# EAGLE design electronics-shield (EAGLE 9.2.2)

## Sheet 1 of 8: Motor controllers
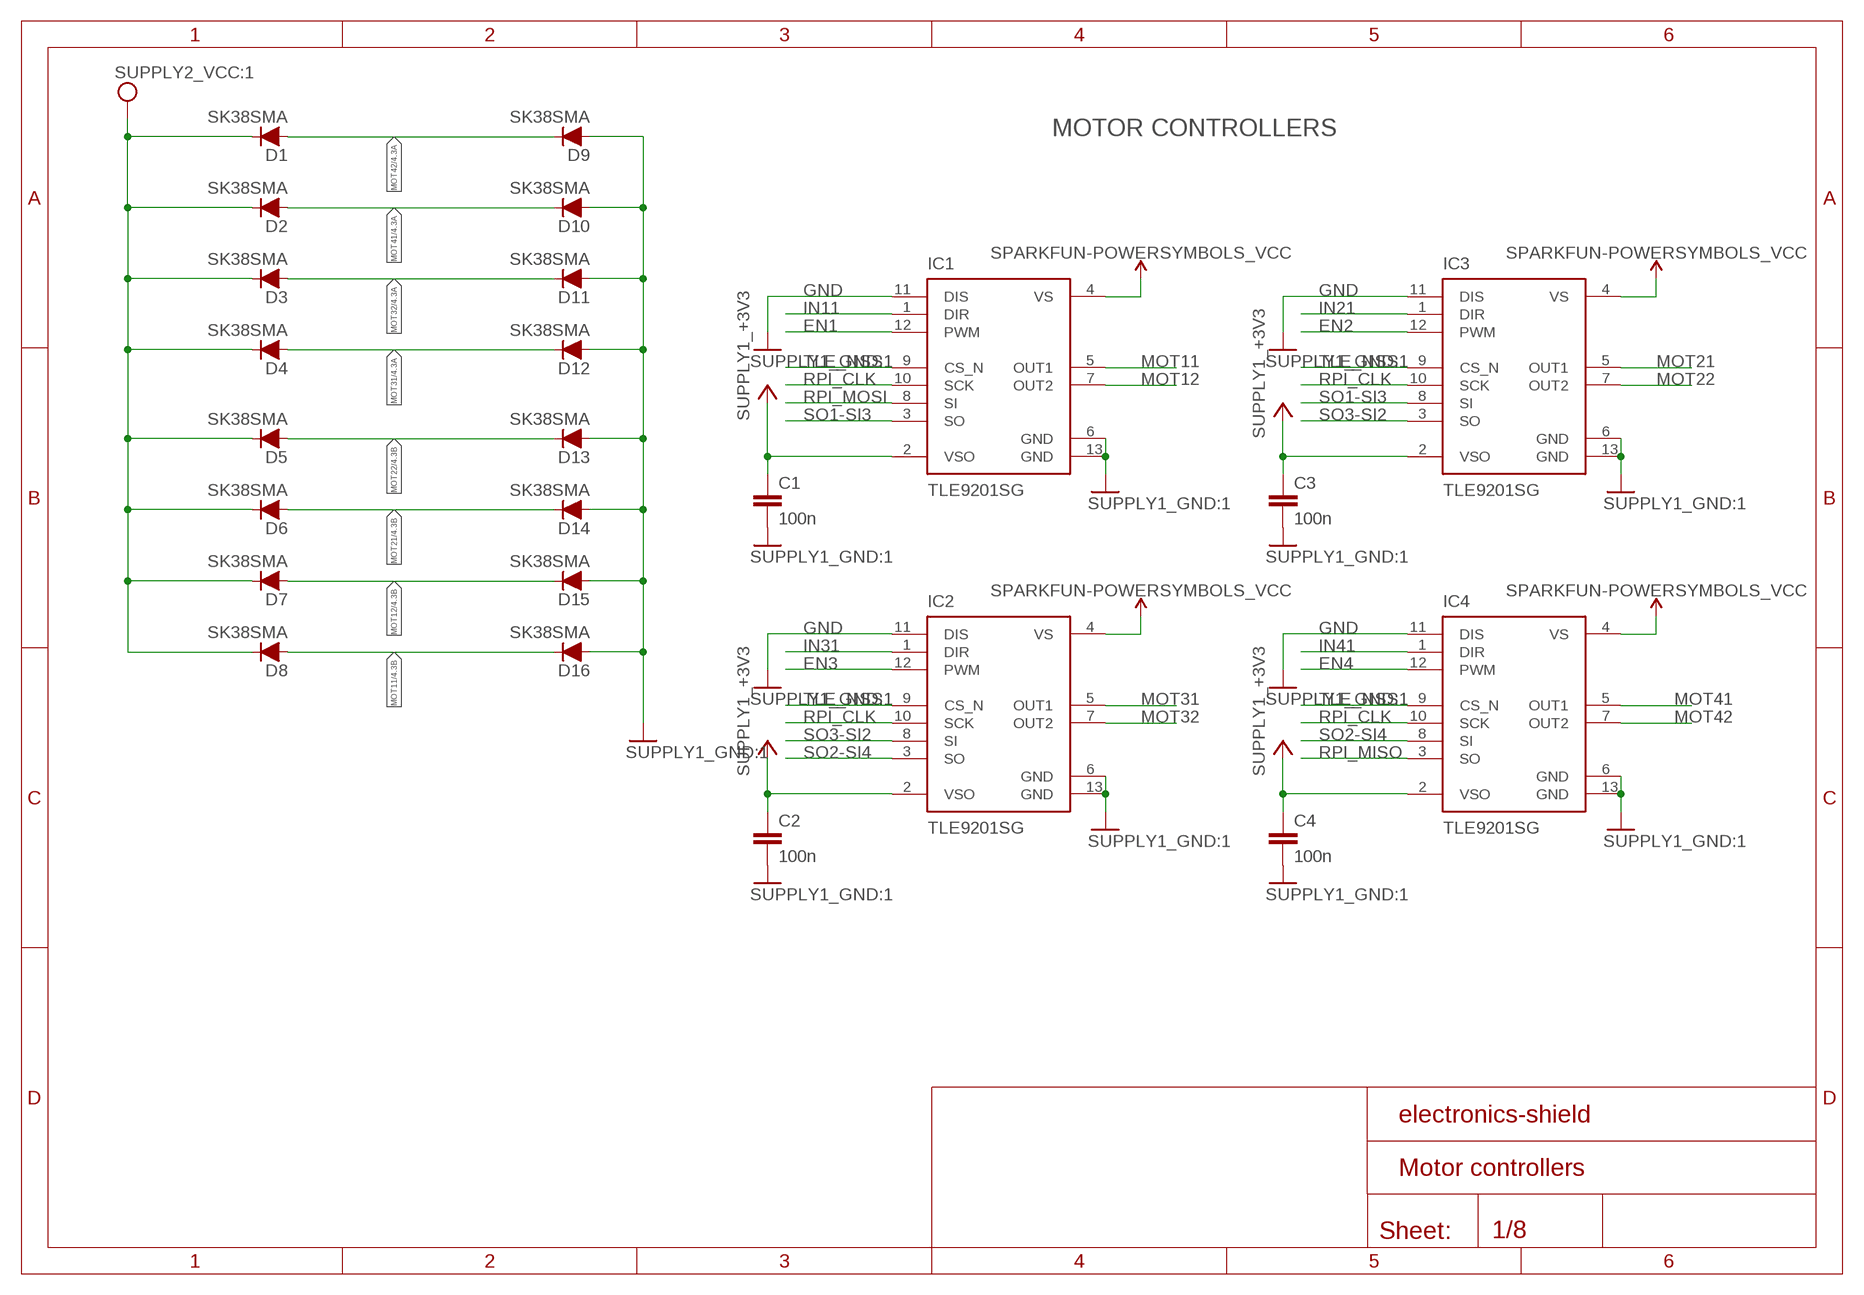
[diagram p0: schematic, sheet 1]

### Parts
C1  100n  CAPACITOR_SMD_0603  [C0603K]
C2  100n  CAPACITOR_SMD_0603  [C0603K]
C3  100n  CAPACITOR_SMD_0603  [C0603K]
C4  100n  CAPACITOR_SMD_0603  [C0603K]
D1  SK38SMA  DIODE_SMD  [SOD123]
D2  SK38SMA  DIODE_SMD  [SOD123]
D3  SK38SMA  DIODE_SMD  [SOD123]
D4  SK38SMA  DIODE_SMD  [SOD123]
D5  SK38SMA  DIODE_SMD  [SOD123]
D6  SK38SMA  DIODE_SMD  [SOD123]
D7  SK38SMA  DIODE_SMD  [SOD123]
D8  SK38SMA  DIODE_SMD  [SOD123]
D9  SK38SMA  DIODE_SMD  [SOD123]
D10  SK38SMA  DIODE_SMD  [SOD123]
D11  SK38SMA  DIODE_SMD  [SOD123]
D12  SK38SMA  DIODE_SMD  [SOD123]
D13  SK38SMA  DIODE_SMD  [SOD123]
D14  SK38SMA  DIODE_SMD  [SOD123]
D15  SK38SMA  DIODE_SMD  [SOD123]
D16  SK38SMA  DIODE_SMD  [SOD123]
IC1  TLE9201SG  [PG-DSO-12-9]
IC2  TLE9201SG  [PG-DSO-12-9]
IC3  TLE9201SG  [PG-DSO-12-9]
IC4  TLE9201SG  [PG-DSO-12-9]

### Nets
+3V3 [NET_POWER_SMALL]: C1.1 C2.1 C3.1 C4.1 IC1.2(VSO) IC2.2(VSO) IC3.2(VSO) IC4.2(VSO) ; supply symbol labelled SUPPLY1_+3V3 ; also sheet 2,3,5,7,8
EN1: IC1.12(PWM) ; also sheet 2
EN2: IC3.12(PWM) ; also sheet 2
EN3: IC2.12(PWM) ; also sheet 2
EN4: IC4.12(PWM) ; also sheet 2
GND [NET_DIFFERET]: C1.2 C2.2 C3.2 C4.2 D9.2(A) D10.2(A) D11.2(A) D12.2(A) D13.2(A) D14.2(A) D15.2(A) D16.2(A) IC1.6(GND) IC1.11(DIS) IC1.13(GND) IC2.6(GND) IC2.11(DIS) IC2.13(GND) IC3.6(GND) IC3.11(DIS) IC3.13(GND) IC4.6(GND) IC4.11(DIS) IC4.13(GND) ; supply symbol labelled SUPPLY1_GND:1 ; also sheet 2,3,4,6,7,8
IN11: IC1.1(DIR) ; also sheet 2
IN21: IC3.1(DIR) ; also sheet 2
IN31: IC2.1(DIR) ; also sheet 2
IN41: IC4.1(DIR) ; also sheet 2
MOT11 [NET_DIFFERET]: D8.2(A) D16.1(C) IC1.5(OUT1) ; also sheet 4
MOT12 [NET_DIFFERET]: D7.2(A) D15.1(C) IC1.7(OUT2) ; also sheet 4
MOT21 [NET_DIFFERET]: D6.2(A) D14.1(C) IC3.5(OUT1) ; also sheet 4
MOT22 [NET_DIFFERET]: D5.2(A) D13.1(C) IC3.7(OUT2) ; also sheet 4
MOT31 [NET_DIFFERET]: D4.2(A) D12.1(C) IC2.5(OUT1) ; also sheet 4
MOT32 [NET_DIFFERET]: D3.2(A) D11.1(C) IC2.7(OUT2) ; also sheet 4
MOT41 [NET_DIFFERET]: D2.2(A) D10.1(C) IC4.5(OUT1) ; also sheet 4
MOT42 [NET_DIFFERET]: D1.2(A) D9.1(C) IC4.7(OUT2) ; also sheet 4
RPI_CLK: IC1.10(SCK) IC2.10(SCK) IC3.10(SCK) IC4.10(SCK) ; also sheet 2,4,6
RPI_MISO: IC4.3(SO) ; also sheet 2,4,6
RPI_MOSI: IC1.8(SI) ; also sheet 2,4,6
SO1-SI3: IC1.3(SO) IC3.8(SI)
SO2-SI4: IC2.3(SO) IC4.8(SI)
SO3-SI2: IC2.8(SI) IC3.3(SO)
TLE_NSS: IC1.9(CS_N) IC2.9(CS_N) IC3.9(CS_N) IC4.9(CS_N) ; also sheet 2
VCC [NET_DIFFERET]: D1.1(C) D2.1(C) D3.1(C) D4.1(C) D5.1(C) D6.1(C) D7.1(C) D8.1(C) IC1.4(VS) IC2.4(VS) IC3.4(VS) IC4.4(VS) ; supply symbol labelled SUPPLY2_VCC:1, SPARKFUN-POWERSYMBOLS_VCC ; also sheet 3,4,8

### Notes on the sheet
- MOTOR CONTROLLERS

## Sheet 2 of 8: Microcontroller connections
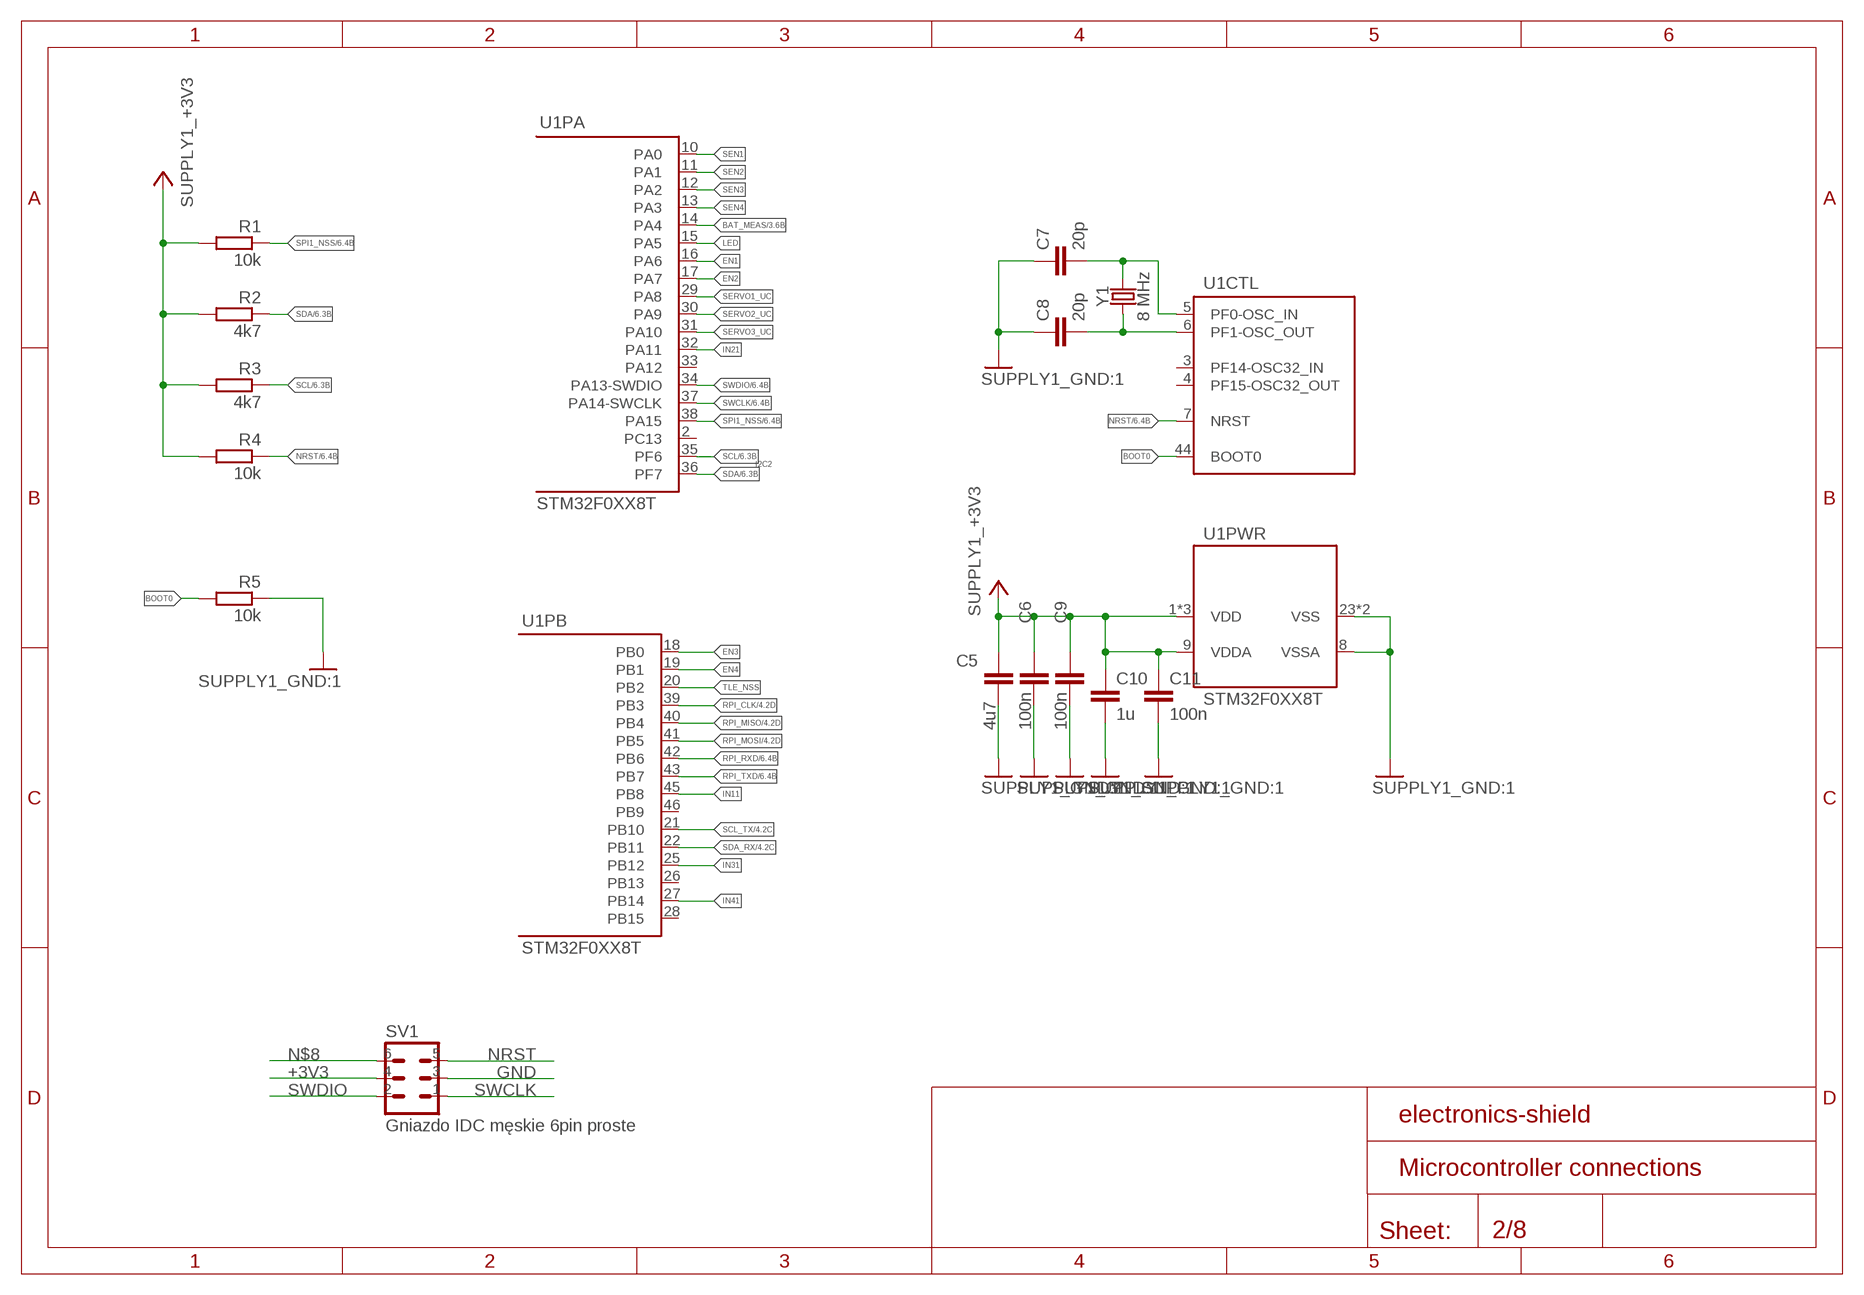
[diagram p1: schematic, sheet 2]

### Parts
C5  4u7  CAPACITOR_SMD_0603  [C0603K]
C6  100n  CAPACITOR_SMD_0603  [C0603K]
C7  20p  CAPACITOR_SMD_0603  [C0603K]
C8  20p  CAPACITOR_SMD_0603  [C0603K]
C9  100n  CAPACITOR_SMD_0603  [C0603K]
C10  1u  CAPACITOR_SMD_0603  [C0603K]
C11  100n  CAPACITOR_SMD_0603  [C0603K]
R1  10k  RESISTOR_SMD_0603  [R0603]
R2  4k7  RESISTOR_SMD_0603  [R0603]
R3  4k7  RESISTOR_SMD_0603  [R0603]
R4  10k  RESISTOR_SMD_0603  [R0603]
R5  10k  RESISTOR_SMD_0603  [R0603]
SV1  Gniazdo IDC męskie 6pin proste  ML6  [ML6]
U1  STM32F0XX8T  [LQFP48]
Y1  8 MHz  CRYSTAL  [HC49UP]

### Nets
+3V3 [NET_POWER_SMALL]: C5.1 C6.1 C9.1 C10.1 C11.1 R1.2 R2.2 R3.2 R4.2 SV1.4 U1.1(PWR:VDD) U1.9(PWR:VDDA) U1.24(PWR:VDD) U1.48(PWR:VDD) ; supply symbol labelled SUPPLY1_+3V3 ; also sheet 1,3,5,7,8
BAT_MEAS: U1.14(PA:PA4) ; also sheet 3
BOOT0: R5.2 U1.44(CTL:BOOT0)
EN1: U1.16(PA:PA6) ; also sheet 1
EN2: U1.17(PA:PA7) ; also sheet 1
EN3: U1.18(PB:PB0) ; also sheet 1
EN4: U1.19(PB:PB1) ; also sheet 1
GND [NET_DIFFERET]: C5.2 C6.2 C7.1 C8.1 C9.2 C10.2 C11.2 R5.1 SV1.3 U1.8(PWR:VSSA) U1.23(PWR:VSS) U1.47(PWR:VSS) ; supply symbol labelled SUPPLY1_GND:1 ; also sheet 1,3,4,6,7,8
IN11: U1.45(PB:PB8) ; also sheet 1
IN21: U1.32(PA:PA11) ; also sheet 1
IN31: U1.25(PB:PB12) ; also sheet 1
IN41: U1.27(PB:PB14) ; also sheet 1
LED: U1.15(PA:PA5)
N$8: SV1.6
NRST: R4.1 SV1.5 U1.7(CTL:NRST) ; also sheet 6
OSCILATOR_N [DIFF_PAIR]: C7.2 U1.5(CTL:PF0-OSC_IN) Y1.2
OSCILATOR_P [DIFF_PAIR]: C8.2 U1.6(CTL:PF1-OSC_OUT) Y1.1
RPI_CLK: U1.39(PB:PB3) ; also sheet 1,4,6
RPI_MISO: U1.40(PB:PB4) ; also sheet 1,4,6
RPI_MOSI: U1.41(PB:PB5) ; also sheet 1,4,6
RPI_RXD: U1.42(PB:PB6) ; also sheet 6
RPI_TXD: U1.43(PB:PB7) ; also sheet 6
SCL: R3.1 U1.35(PA:PF6) ; also sheet 6,7
SCL_TX: U1.21(PB:PB10) ; also sheet 4
SDA: R2.1 U1.36(PA:PF7) ; also sheet 6,7
SDA_RX: U1.22(PB:PB11) ; also sheet 4
SEN1: U1.10(PA:PA0)
SEN2: U1.11(PA:PA1)
SEN3: U1.12(PA:PA2)
SEN4: U1.13(PA:PA3)
SERVO1_UC: U1.29(PA:PA8) ; also sheet 5
SERVO2_UC: U1.30(PA:PA9) ; also sheet 5
SERVO3_UC: U1.31(PA:PA10) ; also sheet 5
SPI1_NSS: R1.1 U1.38(PA:PA15) ; also sheet 6
SWCLK: SV1.1 U1.37(PA:PA14-SWCLK) ; also sheet 6
SWDIO: SV1.2 U1.34(PA:PA13-SWDIO) ; also sheet 6
TLE_NSS: U1.20(PB:PB2) ; also sheet 1
Unconnected: U1.2(PA:PC13) U1.3(CTL:PF14-OSC32_IN) U1.4(CTL:PF15-OSC32_OUT) U1.26(PB:PB13) U1.28(PB:PB15) U1.33(PA:PA12) U1.46(PB:PB9)

### Notes on the sheet
- I2C2

## Sheet 3 of 8: Power supply
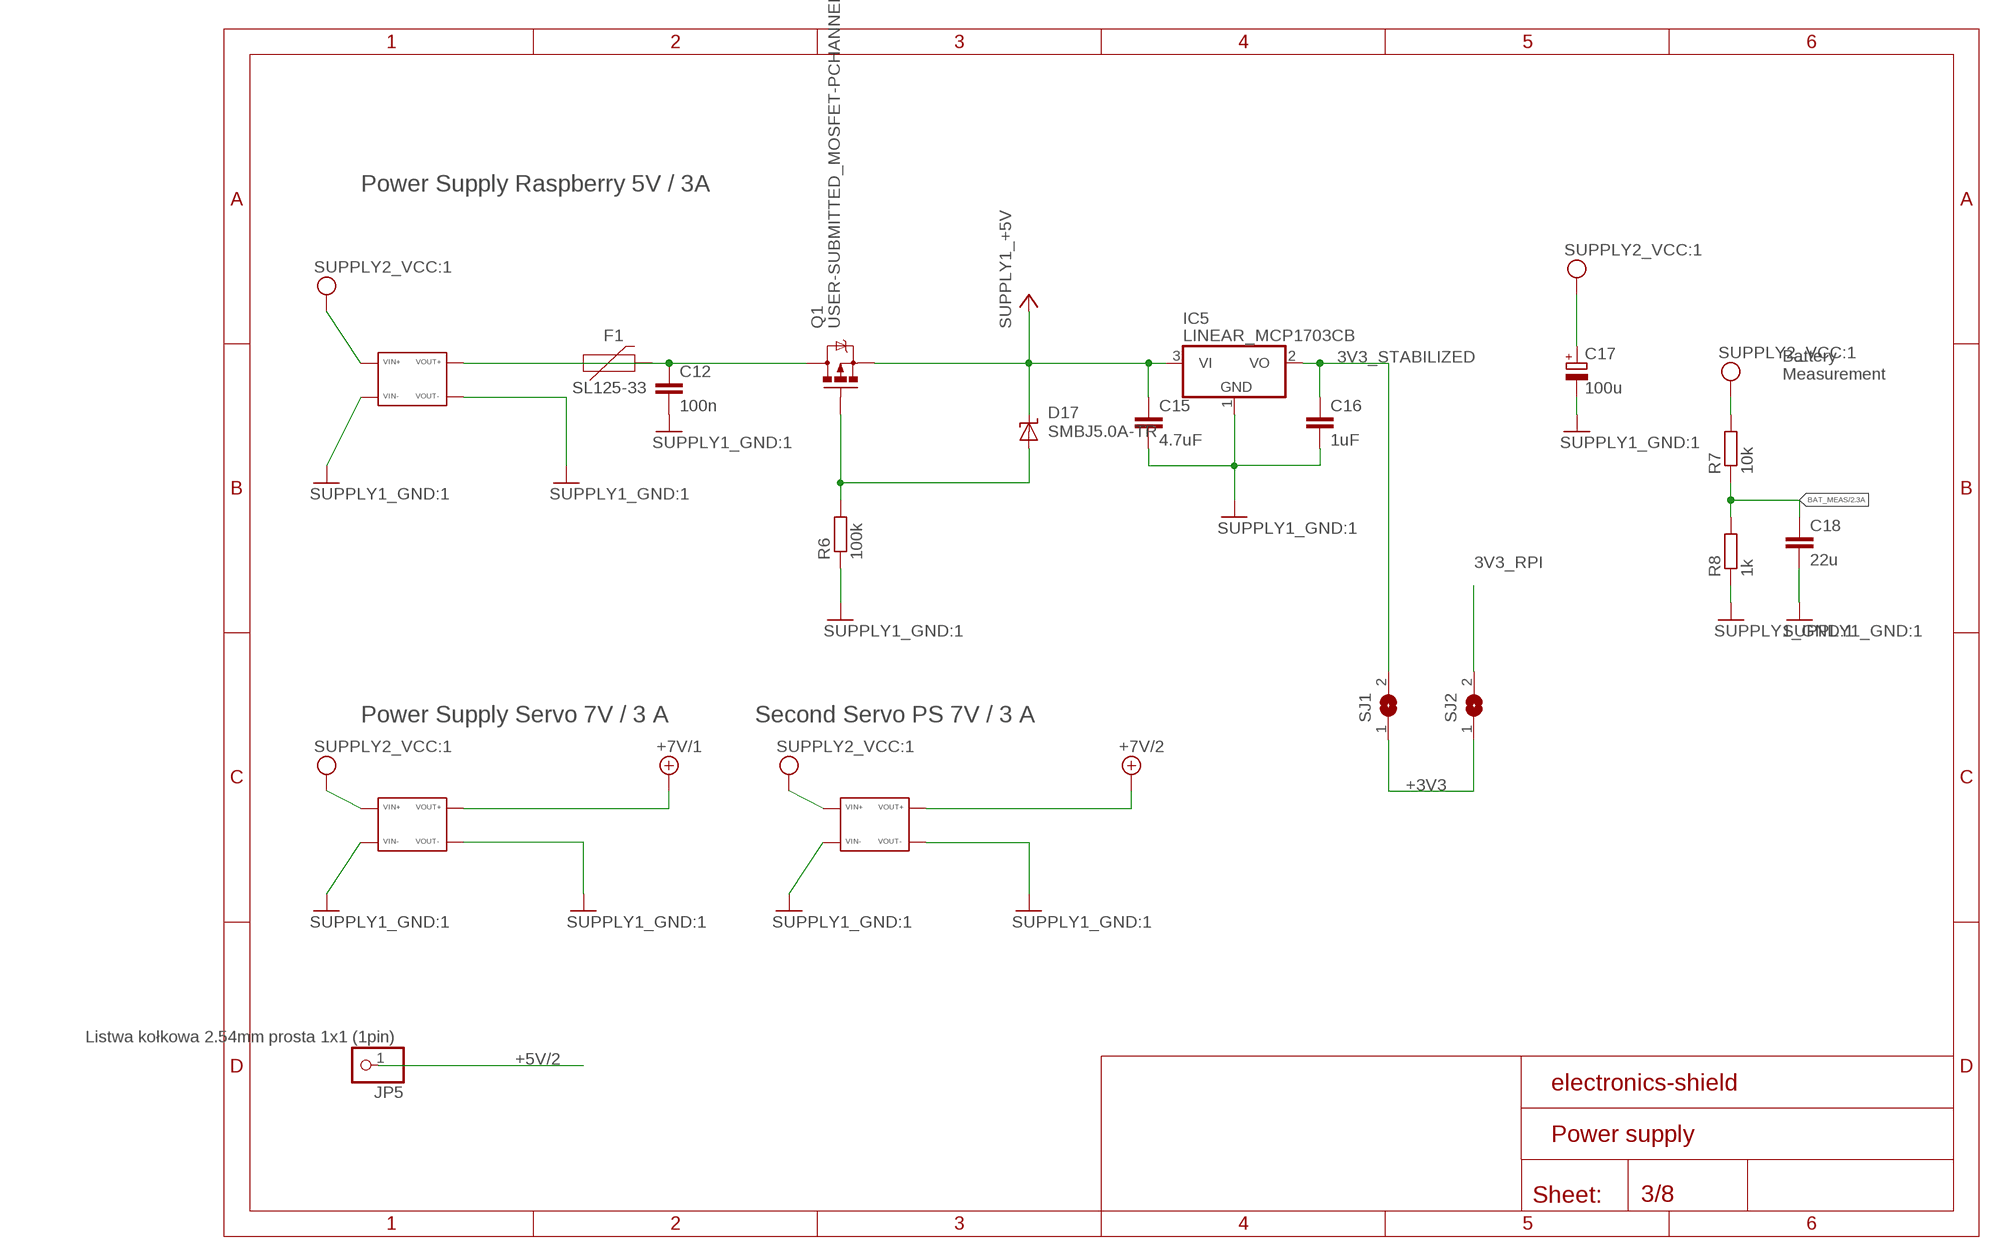
[diagram p2: schematic, sheet 3]

### Parts
C12  100n  CAPACITOR_SMD_0603  [C0603K]
C15  4.7uF  CAPACITOR_SMD_0603  [C0603K]
C16  1uF  CAPACITOR_SMD_0603  [C0603K]
C17  100u  CAPACITOR_POL_SMD  [FI8_6.2]
C18  22u  CAPACITOR_SMD_0603  [C0603K]
D17  SMBJ5.0A-TR  SUPPRESSOR-SMBJ  [SMBJ]
F1  SL125-33  PPTCD  [FUSC7351X125]
IC5  LINEAR_MCP1703CB  [LINEAR_SOT23]
IC6  Moduł przetwornicy DC-DC Step-down 4.5..28V --- regulowane 0.8..20V MP1584  MP1584_MODULE  [DC-BRICK]
IC7  Moduł przetwornicy DC-DC Step-down 4.5..28V --- regulowane 0.8..20V MP1584  MP1584_MODULE  [DC-BRICK]
IC8  Moduł przetwornicy DC-DC Step-down 4.5..28V --- regulowane 0.8..20V MP1584  MP1584_MODULE  [DC-BRICK]
JP5  Listwa kołkowa 2.54mm prosta 1x1 (1pin)  PINHD-1X1  [1X01]
Q1  USER-SUBMITTED_MOSFET-PCHANNELSMD  [USER-SUBMITTED_SOT23-3]
R6  100k  RESISTOR_SMD_0603  [R0603]
R7  10k  RESISTOR_SMD_0603  [R0603]
R8  1k  RESISTOR_SMD_0603  [R0603]
SJ1  SOLDER_JUMPER  [SJ]
SJ2  SOLDER_JUMPER  [SJ]

### Nets
3V3_RPI: SJ2.2 ; also sheet 6
3V3_STABILIZED: C16.1 IC5.2(VO) SJ1.2
5V_NOT_TRIMMED [NET_DIFFERET]: C12.1 F1.1 Q1.3(D)
+3V3 [NET_POWER_SMALL]: SJ1.1 SJ2.1 ; also sheet 1,2,5,7,8
+5V [NET_POWER_SMALL]: C15.1 D17.C IC5.3(VI) Q1.2(S) ; supply symbol labelled SUPPLY1_+5V ; also sheet 4,5,6,8
+5V/2 [NET_POWER_SMALL]: JP5.1 ; also sheet 4
+5V_RAW [NET_DIFFERET]: F1.2 IC6.OUT1+1(VOUT+)
+7V/1 [NET_DIFFERET]: IC7.OUT1+1(VOUT+) ; also sheet 4
+7V/2 [NET_DIFFERET]: IC8.OUT1+1(VOUT+) ; also sheet 4
BAT_MEAS: C18.1 R7.1 R8.2 ; also sheet 2
D1-R3 [NET_DIFFERET]: D17.A Q1.1(G) R6.2
GND [NET_DIFFERET]: C12.2 C15.2 C16.2 C17.- C18.2 IC5.1(GND) IC6.IN1-1(VIN-) IC6.OUT1-1(VOUT-) IC7.IN1-1(VIN-) IC7.OUT1-1(VOUT-) IC8.IN1-1(VIN-) IC8.OUT1-1(VOUT-) R6.1 R8.1 ; supply symbol labelled SUPPLY1_GND:1 ; also sheet 1,2,4,6,7,8
VCC [NET_DIFFERET]: C17.+ IC6.IN1+1(VIN+) IC7.IN1+1(VIN+) IC8.IN1+1(VIN+) R7.2 ; supply symbol labelled SUPPLY2_VCC:1 ; also sheet 1,4,8

### Notes on the sheet
- Power Supply Raspberry 5V / 3A
- Battery
  Measurement
- Power Supply Servo 7V / 3 A | Second Servo PS 7V / 3 A

## Sheet 4 of 8: Connectors
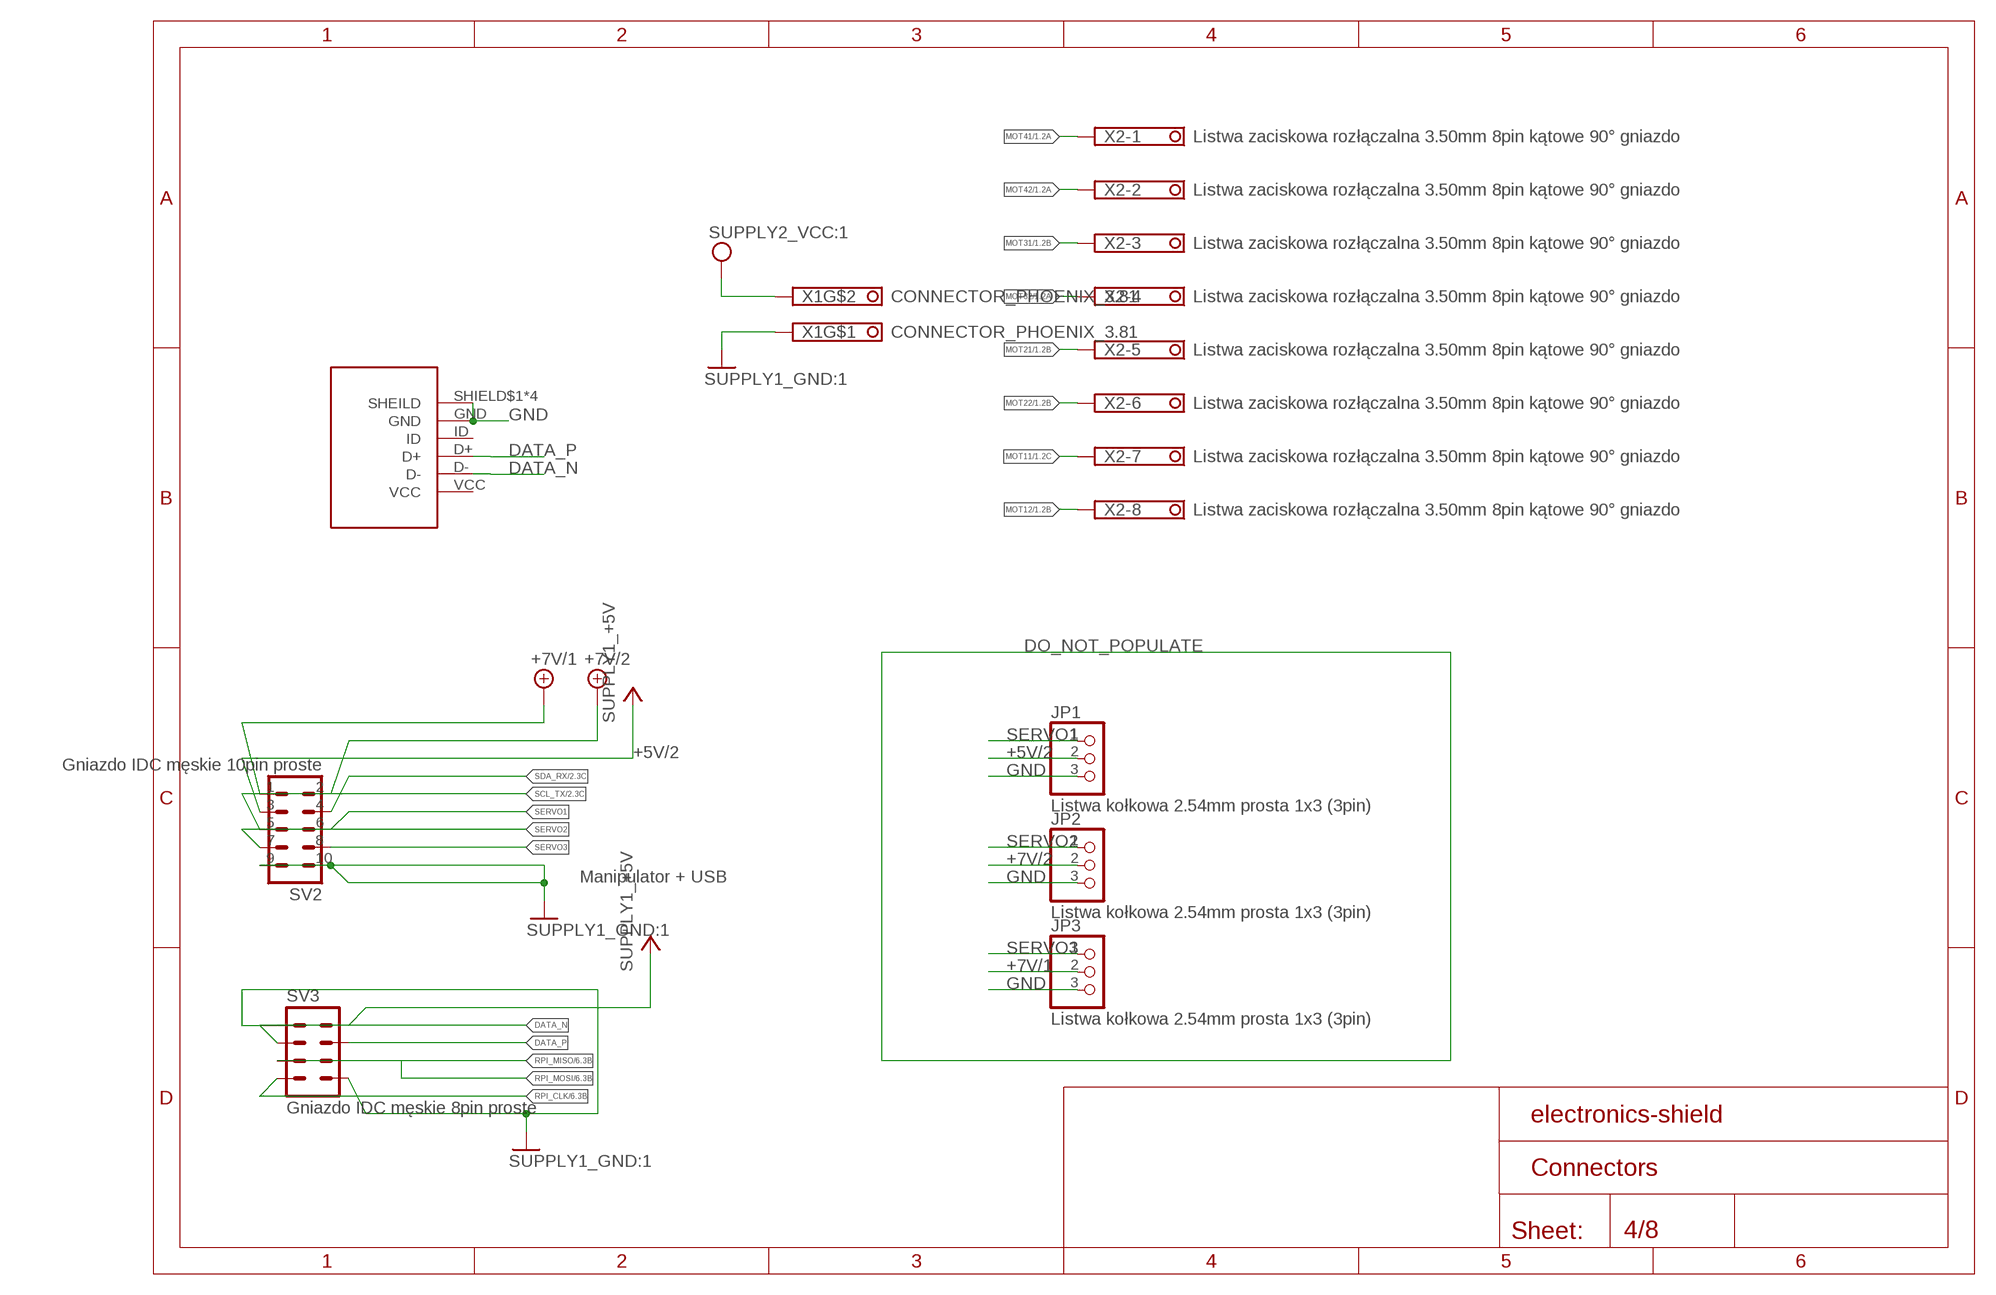
[diagram p3: schematic, sheet 4]

### Parts
J1  USB-MICRO-B  [USB-MICRO-B]
JP1  Listwa kołkowa 2.54mm prosta 1x3 (3pin)  PINHD-1X3_DNP  [1X03_ROUND_DNP]
JP2  Listwa kołkowa 2.54mm prosta 1x3 (3pin)  PINHD-1X3_DNP  [1X03_ROUND_DNP]
JP3  Listwa kołkowa 2.54mm prosta 1x3 (3pin)  PINHD-1X3_DNP  [1X03_ROUND_DNP]
SV2  Gniazdo IDC męskie 10pin proste  ML10  [ML10]
SV3  Gniazdo IDC męskie 8pin proste  ML8  [ML8]
X1  CONNECTOR_PHOENIX_3.81  [3.81MM_2PIN]
X2  Listwa zaciskowa rozłączalna 3.50mm 8pin kątowe 90° gniazdo  CONNECTOR_PHOENIX  [3.5MM_8PIN]

### Nets
+5V [NET_POWER_SMALL]: SV3.2 ; supply symbol labelled SUPPLY1_+5V ; also sheet 3,5,6,8
+5V/2 [NET_POWER_SMALL]: JP1.2 SV2.3 ; supply symbol labelled SUPPLY1_+5V ; also sheet 3
+7V/1 [NET_DIFFERET]: JP3.2 SV2.1 ; also sheet 3
+7V/2 [NET_DIFFERET]: JP2.2 SV2.2 ; also sheet 3
DATA_N [DIFF_PAIR2]: J1.D- SV3.3
DATA_P [DIFF_PAIR2]: J1.D+ SV3.4
GND [NET_DIFFERET]: J1.GND J1.SHIELD$1(SHEILD) J1.SHIELD$2(SHEILD) J1.SHIELD$3(SHEILD) J1.SHIELD$4(SHEILD) JP1.3 JP2.3 JP3.3 SV2.9 SV2.10 SV3.1 SV3.8 X1.1 ; supply symbol labelled SUPPLY1_GND:1 ; also sheet 1,2,3,6,7,8
MOT11 [NET_DIFFERET]: X2.7 ; also sheet 1
MOT12 [NET_DIFFERET]: X2.8 ; also sheet 1
MOT21 [NET_DIFFERET]: X2.5 ; also sheet 1
MOT22 [NET_DIFFERET]: X2.6 ; also sheet 1
MOT31 [NET_DIFFERET]: X2.3 ; also sheet 1
MOT32 [NET_DIFFERET]: X2.4 ; also sheet 1
MOT41 [NET_DIFFERET]: X2.1 ; also sheet 1
MOT42 [NET_DIFFERET]: X2.2 ; also sheet 1
RPI_CLK: SV3.7 ; also sheet 1,2,6
RPI_MISO: SV3.5 ; also sheet 1,2,6
RPI_MOSI: SV3.6 ; also sheet 1,2,6
SCL_TX: SV2.5 ; also sheet 2
SDA_RX: SV2.4 ; also sheet 2
SERVO1: JP1.1 SV2.6 ; also sheet 5
SERVO2: JP2.1 SV2.7 ; also sheet 5
SERVO3: JP3.1 SV2.8 ; also sheet 5
VCC [NET_DIFFERET]: X1.2 ; supply symbol labelled SUPPLY2_VCC:1 ; also sheet 1,3,8
Unconnected: J1.ID J1.VCC

### Notes on the sheet
- Manipulator + USB

## Sheet 5 of 8: Voltage level translators
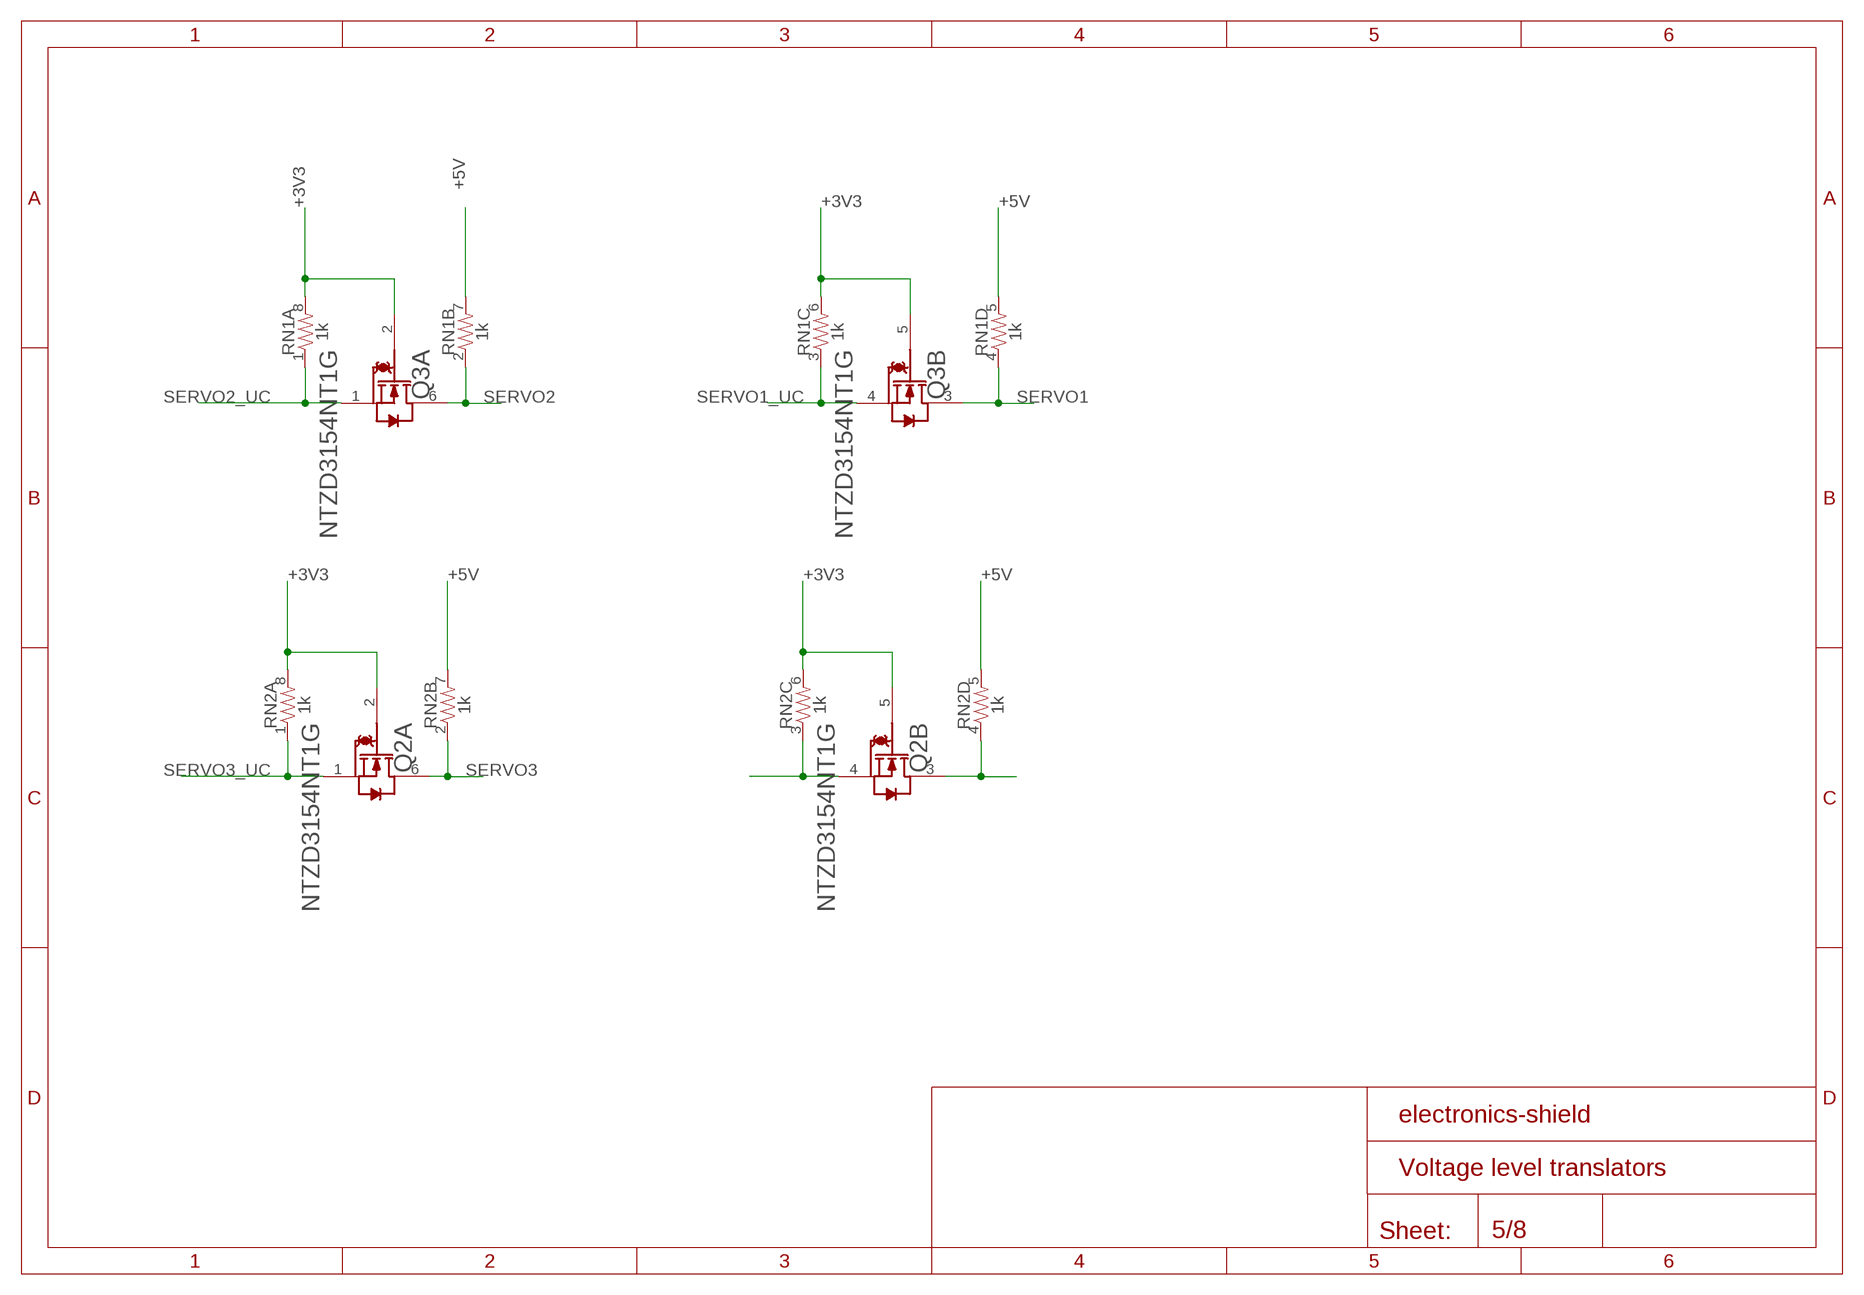
[diagram p4: schematic, sheet 5]

### Parts
Q2  NTZD3154NT1G  ON-SEMICONDUCTOR---NTZD3154NT1G_ON_SEMICONDUCTOR_NTZD3154NT1GON_SEMICONDUCTOR_NTZD3154NT1G_0_0  [ON-SEMICONDUCTOR---NTZD3154NT1G_ON_SEMICONDUCTOR_NTZD3154NT1G_0]
Q3  NTZD3154NT1G  ON-SEMICONDUCTOR---NTZD3154NT1G_ON_SEMICONDUCTOR_NTZD3154NT1GON_SEMICONDUCTOR_NTZD3154NT1G_0_0  [ON-SEMICONDUCTOR---NTZD3154NT1G_ON_SEMICONDUCTOR_NTZD3154NT1G_0]
RN1  1k  1KOHM-ARRAY(4)-0805_ARV-1/10W-5%  [0805-ARV]
RN2  1k  1KOHM-ARRAY(4)-0805_ARV-1/10W-5%  [0805-ARV]

### Nets
+3V3 [NET_POWER_SMALL]: Q2.2(A:G1) Q2.5(B:G2) Q3.2(A:G1) Q3.5(B:G2) RN1.6 RN1.8 RN2.6 RN2.8 ; also sheet 1,2,3,7,8
+5V [NET_POWER_SMALL]: RN1.5 RN1.7 RN2.5 RN2.7 ; also sheet 3,4,6,8
N$14: Q2.4(B:S2) RN2.3
N$16: Q2.3(B:D2) RN2.4
SERVO1: Q3.3(B:D2) RN1.4 ; also sheet 4
SERVO1_UC: Q3.4(B:S2) RN1.3 ; also sheet 2
SERVO2: Q3.6(A:D1) RN1.2 ; also sheet 4
SERVO2_UC: Q3.1(A:S1) RN1.1 ; also sheet 2
SERVO3: Q2.6(A:D1) RN2.2 ; also sheet 4
SERVO3_UC: Q2.1(A:S1) RN2.1 ; also sheet 2

## Sheet 6 of 8: RPi connections
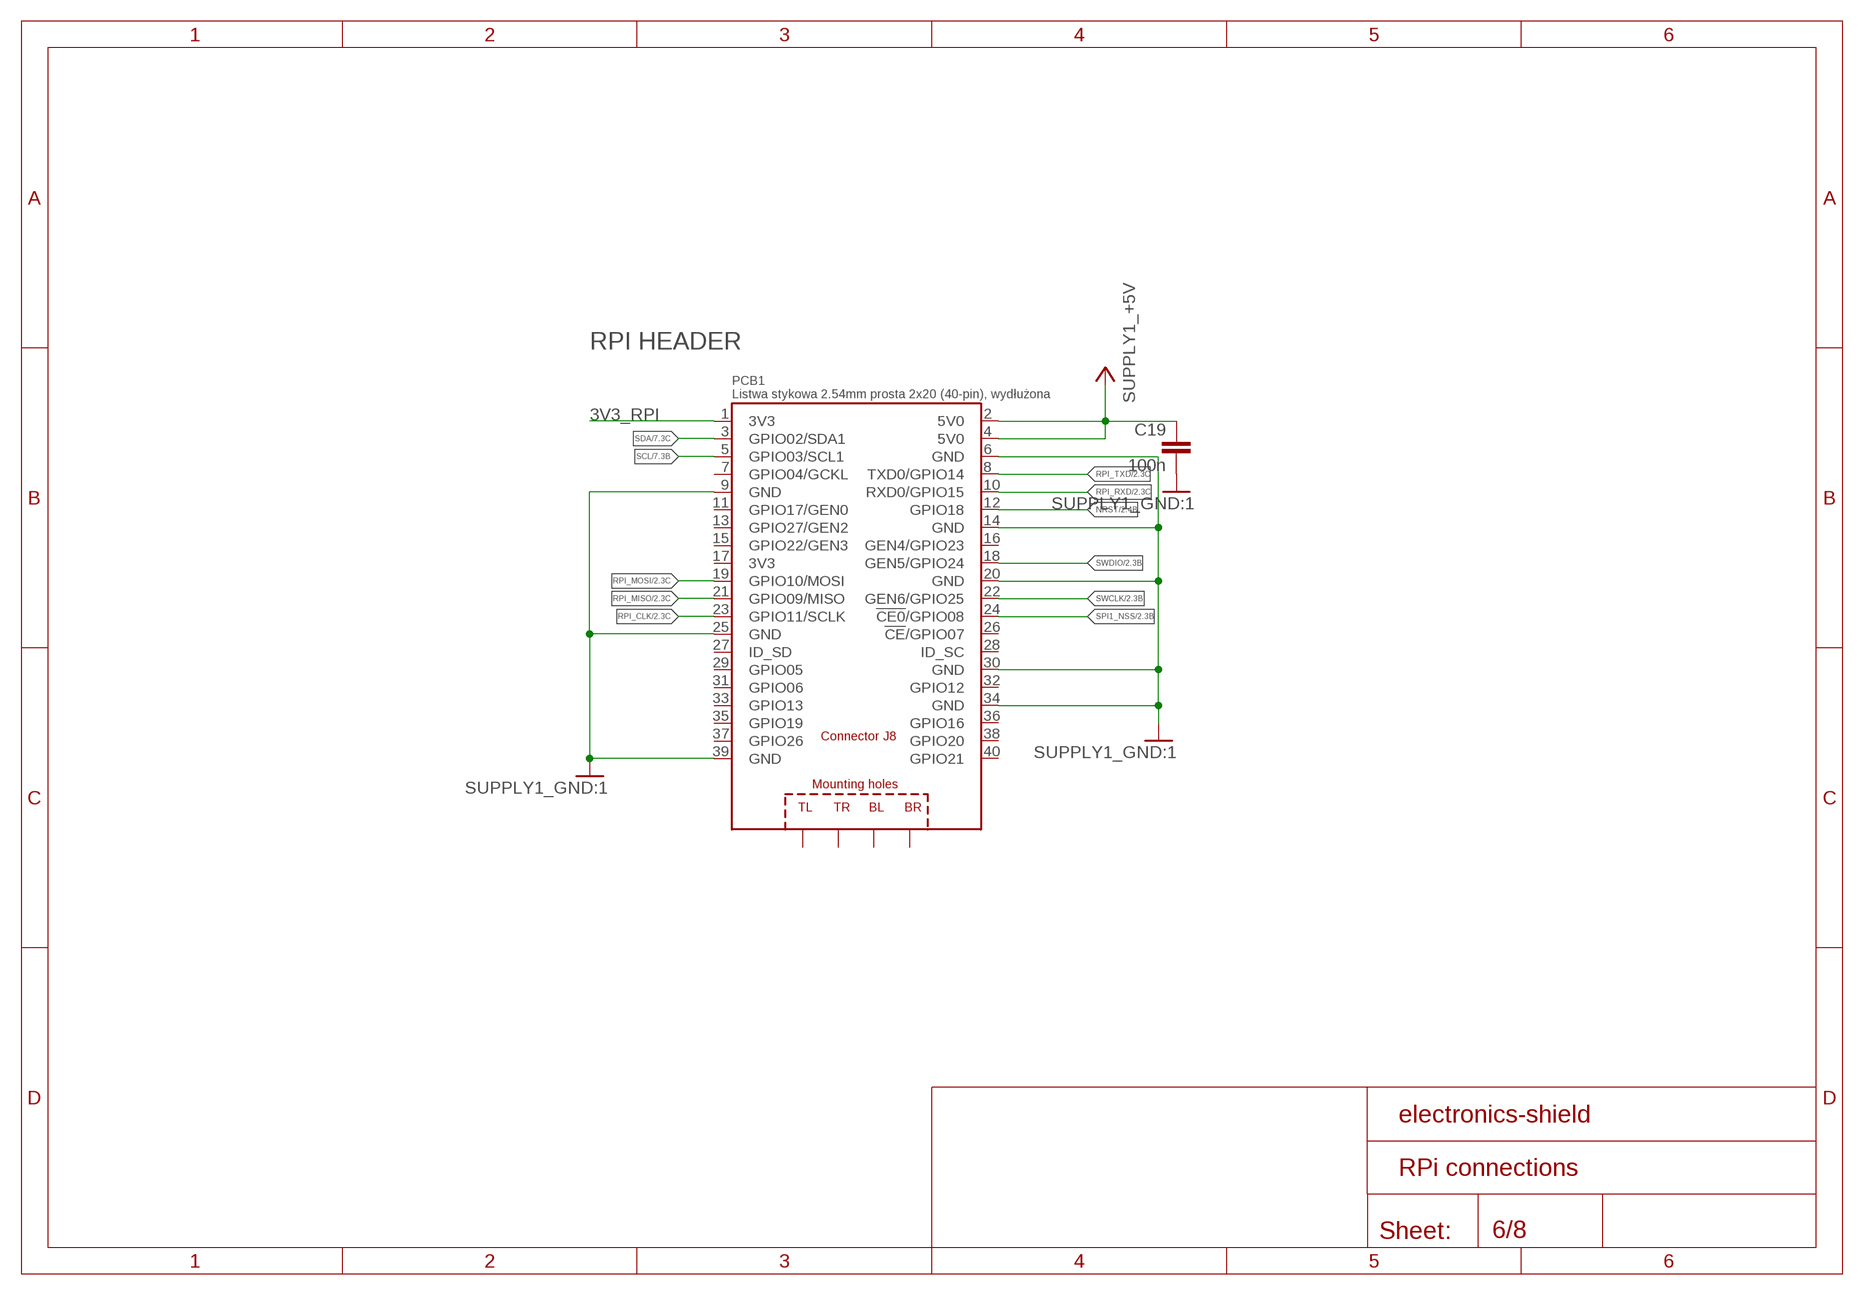
[diagram p5: schematic, sheet 6]

### Parts
C19  100n  CAPACITOR_SMD_0603  [C0603K]
PCB1  Listwa stykowa 2.54mm prosta 2x20 (40-pin), wydłużona  RASPBERRY_PI_B+_TPLACE  [RASPBERRY_PI_B+_CONNECTOR]

### Nets
3V3_RPI: PCB1.1(3V3) ; also sheet 3
+5V [NET_POWER_SMALL]: C19.1 PCB1.2(5V0) PCB1.4(5V0) ; supply symbol labelled SUPPLY1_+5V ; also sheet 3,4,5,8
GND [NET_DIFFERET]: C19.2 PCB1.6(GND) PCB1.9(GND) PCB1.14(GND) PCB1.20(GND) PCB1.25(GND) PCB1.30(GND) PCB1.34(GND) PCB1.39(GND) ; supply symbol labelled SUPPLY1_GND:1 ; also sheet 1,2,3,4,7,8
NRST: PCB1.12(GPIO18) ; also sheet 2
RPI_CLK: PCB1.23(GPIO11/SCLK) ; also sheet 1,2,4
RPI_MISO: PCB1.21(GPIO09/MISO) ; also sheet 1,2,4
RPI_MOSI: PCB1.19(GPIO10/MOSI) ; also sheet 1,2,4
RPI_RXD: PCB1.10(RXD0/GPIO15) ; also sheet 2
RPI_TXD: PCB1.8(TXD0/GPIO14) ; also sheet 2
SCL: PCB1.5(GPIO03/SCL1) ; also sheet 2,7
SDA: PCB1.3(GPIO02/SDA1) ; also sheet 2,7
SPI1_NSS: PCB1.24(!CE0!/GPIO08) ; also sheet 2
SWCLK: PCB1.22(GEN6/GPIO25) ; also sheet 2
SWDIO: PCB1.18(GEN5/GPIO24) ; also sheet 2
Unconnected: PCB1.7(GPIO04/GCKL) PCB1.11(GPIO17/GEN0) PCB1.13(GPIO27/GEN2) PCB1.15(GPIO22/GEN3) PCB1.16(GEN4/GPIO23) PCB1.26(!CE!/GPIO07) PCB1.27(ID_SD) PCB1.28(ID_SC) PCB1.29(GPIO05) PCB1.31(GPIO06) PCB1.32(GPIO12) PCB1.33(GPIO13) PCB1.35(GPIO19) PCB1.36(GPIO16) PCB1.37(GPIO26) PCB1.38(GPIO20) PCB1.40(GPIO21) PCB1.PE_BL(BL) PCB1.PE_BR(BR) PCB1.PE_TL(TL) PCB1.PE_TR(TR)

### Notes on the sheet
- RPI HEADER

## Sheet 7 of 8: EEPROM
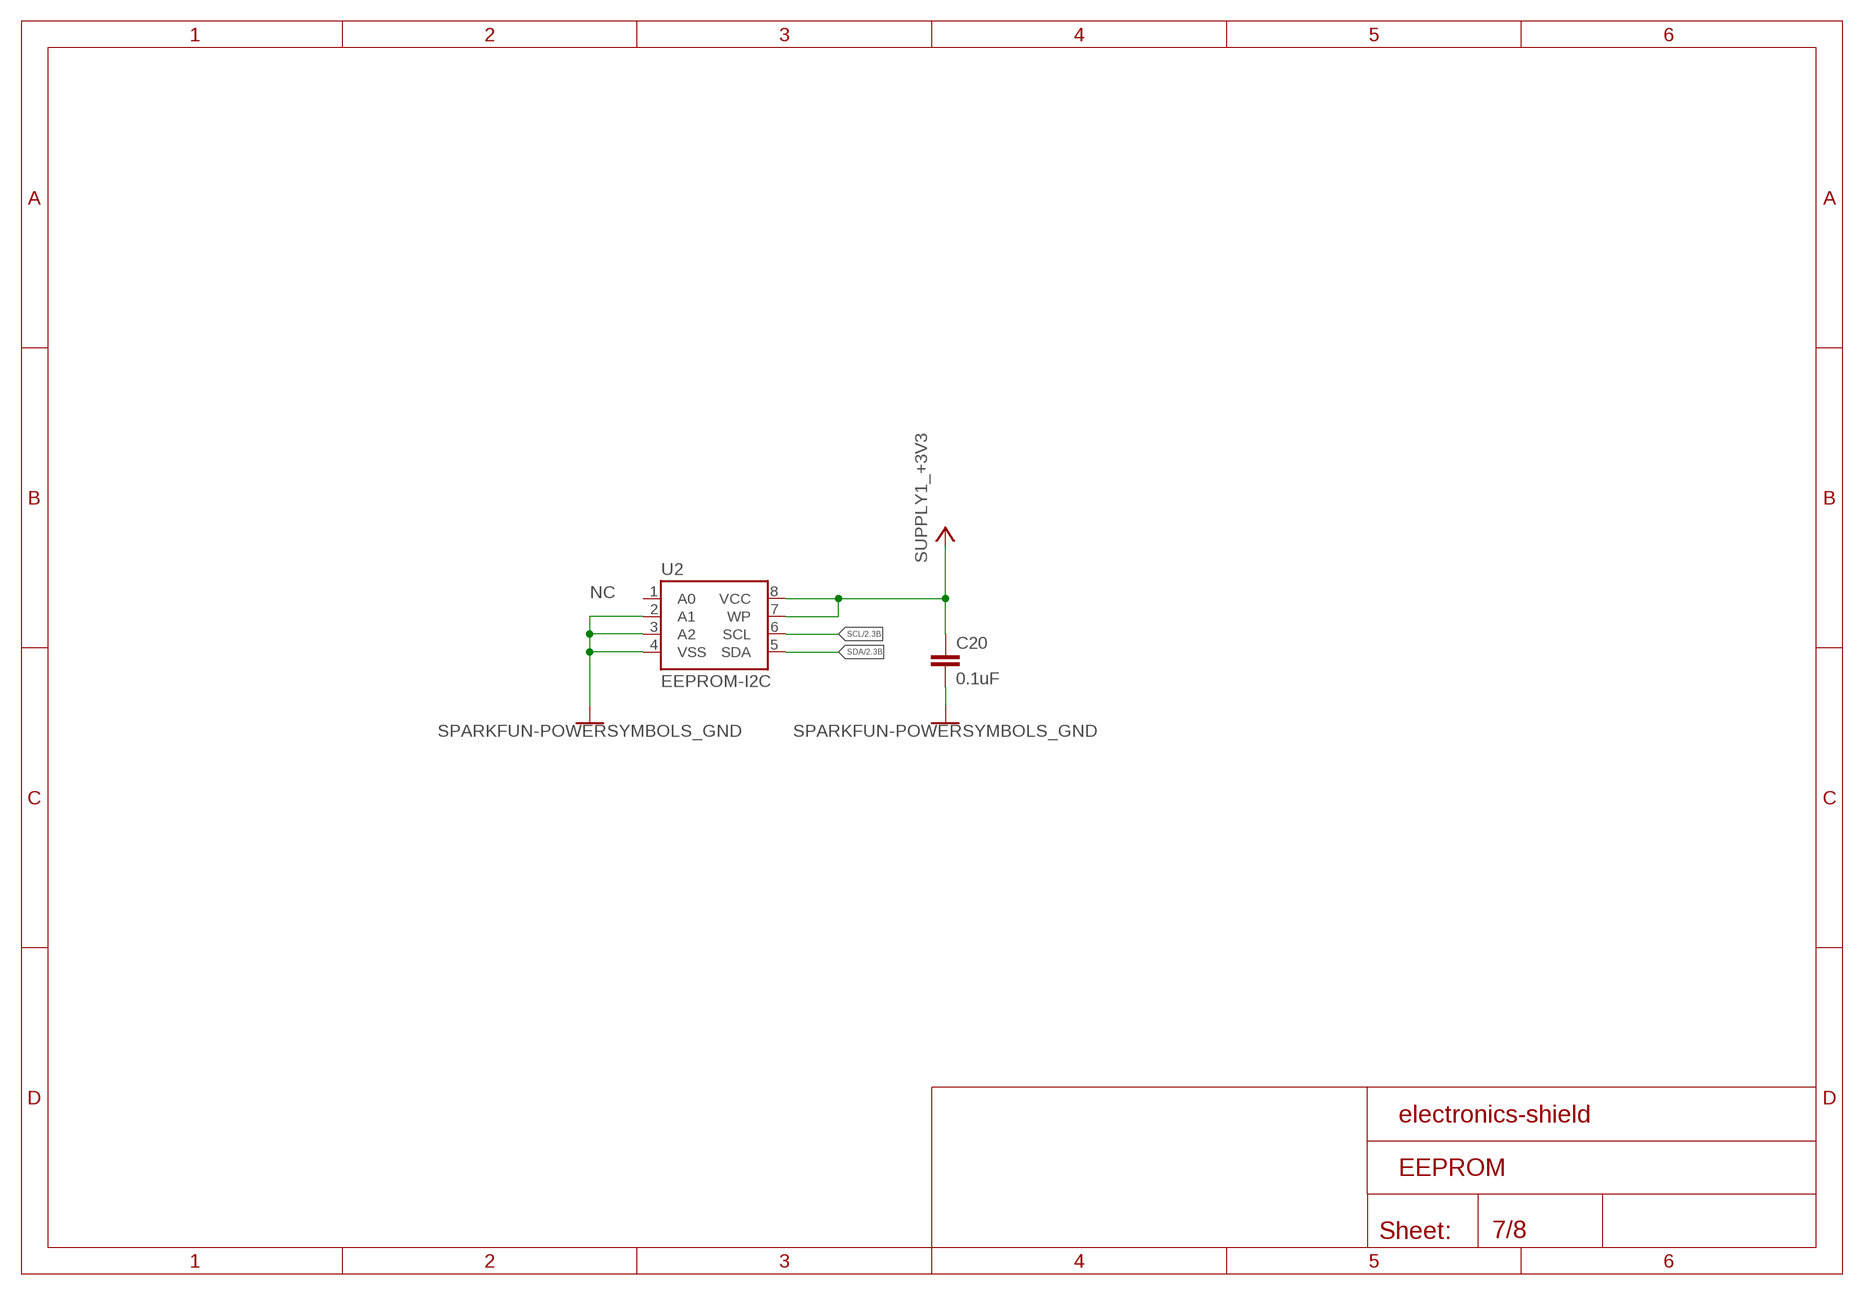
[diagram p6: schematic, sheet 7]

### Parts
C20  0.1uF  CAPACITOR_SMD_0603  [C0603K]
U2  EEPROM-I2C  [SO-08]

### Nets
+3V3 [NET_POWER_SMALL]: C20.1 U2.7(WP) U2.8(VCC) ; supply symbol labelled SUPPLY1_+3V3 ; also sheet 1,2,3,5,8
GND [NET_DIFFERET]: C20.2 U2.2(A1) U2.3(A2) U2.4(VSS) ; supply symbol labelled SPARKFUN-POWERSYMBOLS_GND ; also sheet 1,2,3,4,6,8
SCL: U2.6(SCL) ; also sheet 2,6
SDA: U2.5(SDA) ; also sheet 2,6
Unconnected: U2.1(A0)

### Notes on the sheet
- NC

## Sheet 8 of 8: TEST POINTS
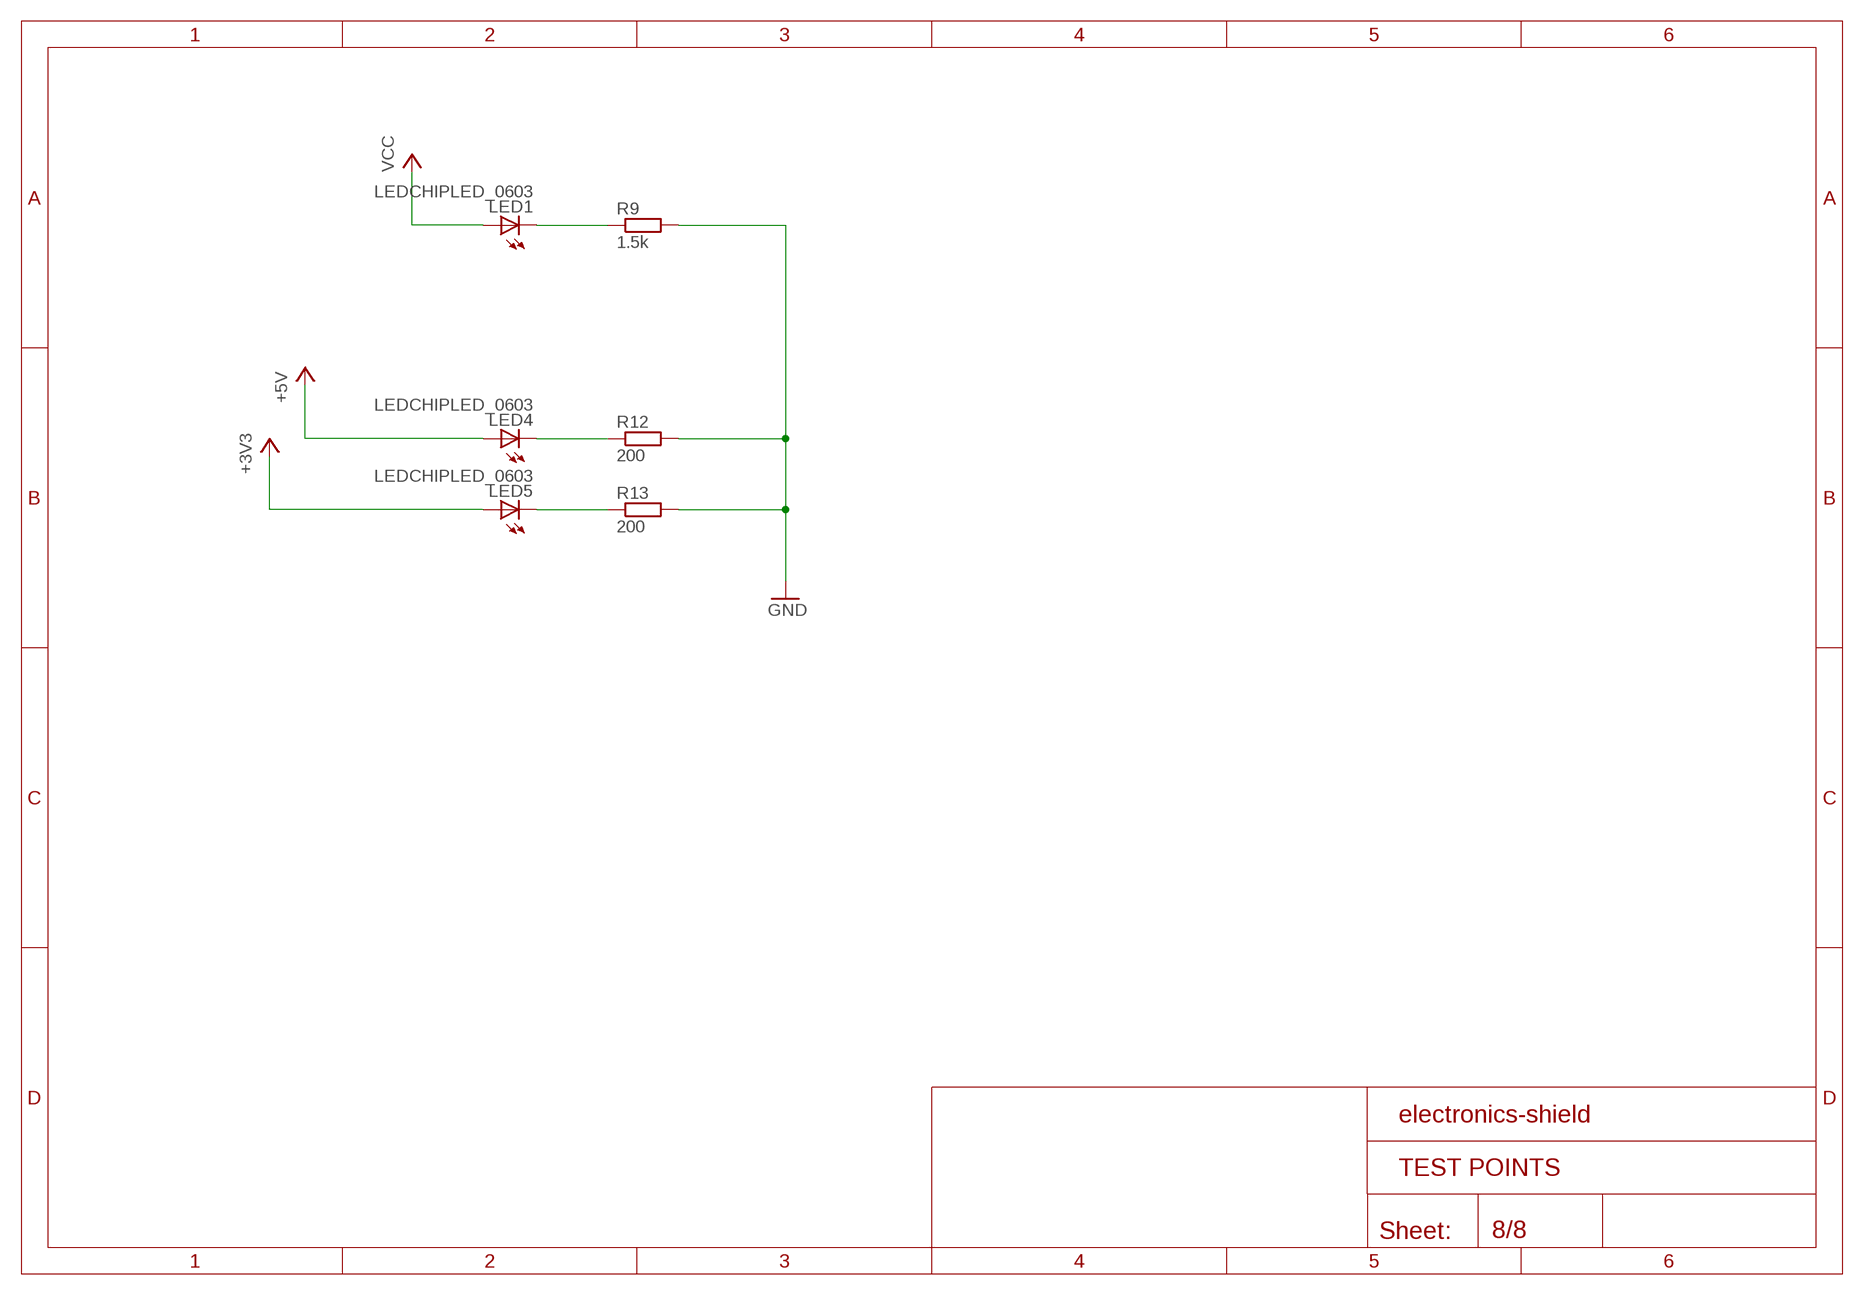
[diagram p7: schematic, sheet 8]

### Parts
LED1  LEDCHIPLED_0603  [CHIPLED_0603]
LED4  LEDCHIPLED_0603  [CHIPLED_0603]
LED5  LEDCHIPLED_0603  [CHIPLED_0603]
R9  1.5k  RESISTOR_SMD_0603  [R0603]
R12  200  RESISTOR_SMD_0603  [R0603]
R13  200  RESISTOR_SMD_0603  [R0603]

### Nets
+3V3 [NET_POWER_SMALL]: LED5.A ; also sheet 1,2,3,5,7
+5V [NET_POWER_SMALL]: LED4.A ; also sheet 3,4,5,6
GND [NET_DIFFERET]: R9.2 R12.2 R13.2 ; also sheet 1,2,3,4,6,7
N$1: LED1.C R9.1
N$4: LED4.C R12.1
N$5: LED5.C R13.1
VCC [NET_DIFFERET]: LED1.A ; also sheet 1,3,4

## Power pins joined to a net without a drawn wire
3V3: PCB1.17(3V3)

## Library data of the parts
C1-C12 C15 C16 C19 C20 = Kell Ideas:CAPACITOR_SMD
C17 = Kell Ideas:CAPACITOR_POL_SMD; LINK: http://www.tme.eu/pl/details/sc1e107m0806bvr/kondensatory-elektrolityczne-smd-85c/samwha/
C18 = Kell Ideas:CAPACITOR_SMD; LINK: http://www.tme.eu/pl/details/cl21a476mqynnng/kondensatory-mlcc-smd-0805/samsung/
D1-D10 D12-D16 = Kell Ideas:DIODE_SMD: DIODE filled; LINK: http://www.tme.eu/pl/details/sk38sma-dio/diody-schottky-smd/diotec-semiconductor/sk38sma/
D11 = Kell Ideas:DIODE_SMD: DIODE filled; LINK: http://www.tme.eu/pl/details/sk38sma-dio/diody-schottky-smd/diotec-semiconductor/sk38sma/; SPICEPREFIX: D
D17 = Kell Ideas:SUPPRESSOR-: Suppressor diode; LINK: http://www.tme.eu/pl/details/smbj5.0a-tr/diody-transil-smd-jednokierunkowe/st-microelectronics/
F1 = Kell Ideas:PPTC; LINK: http://www.tme.eu/pl/details/sl125-33/bezpieczniki-polimerowe-smd/ece/
IC1-IC4 = Kell Ideas:TLE9201SG: Infineon TLE9201SG, BLDC Motor Driver IC, 28 V 6A 12-Pin, DSO-12-17 Source: Datasheet <https://www.infineon.com/cms/en/product/packages/PG-DSO/PG-DSO-12-17/>; ARROW_PART_NUMBER: TLE9201SG; ARROW_PRICE/STOCK: http://uk.rs-online.com/web/p/products/1661194; DESCRIPTION: Infineon TLE9201SG, BLDC Motor Driver IC, 28 V 6A 12-Pin, DSO-12-17; HEIGHT: mm; MANUFACTURER_NAME: Infineon; MANUFACTURER_PART_NUMBER: TLE9201SG; RS_PART_NUMBER: 1661194; RS_PRICE/STOCK: http://uk.rs-online.com/web/p/products/1661194
IC5 = electronics-shield:LINEAR_MCP1703: 250 mA, 16V, Low Quiescent Current LDO Regulator Source: http://ww1.microchip.com/downloads/en/DeviceDoc/22049b.pdf
IC6-IC8 = Kell Ideas:MP1584_MODULE: MP1584-dc-brick-pcb Step down Input: 4.5V - 28V Ouput 0.8V - 25V max. 3A Cheap on ebay
J1 = Kell Ideas:USB-MICRO-B
JP1-JP3 = Kell Ideas:PINHD-1X3: PIN HEADER
JP5 = pinhead:PINHD-1X1: PIN HEADER
LED1 LED4 LED5 = audio amplifier example:LED
PCB1 = Kell Ideas:RASPBERRY_PI_B+: Raspberry Pi B+ Basedon issue: Thursday, July 10, 2014 - Rev 1.2 LBR by Tim Rettmann 07-2014
Q1 = electronics-shield:USER-SUBMITTED_MOSFET-PCHANNEL: Generic PMOSFET IRLML2244 - TRANS-11153 (SOT-23 -20V -4.3A) (1.Gate 2.Source 3.Drain) FQP27P06 - COM-10349 <http://www.sparkfun.com/products/10349> (TO-220 -60V -27A) (1.Gate 2.Source 3.Drain)
Q2 Q3 = electronics-shield:ON-SEMICONDUCTOR---NTZD3154NT1G_ON_SEMICONDUCTOR_NTZD3154NT1G: ONSC-NNMOS-6_F; CHANNEL_POLARITY: N Channel; CIIVA_IDS: 1027366; CISS_TYP_PF: 80; COMPONENT_LINK_1_DESCRIPTION: Manufacturer URL; COMPONENT_LINK_1_URL: http://www.onsemi.com/; COMPONENT_LINK_3_DESCRIPTION: Package Specification; COMPONENT_LINK_3_URL: http://www.onsemi.cn/pub_link/Collateral/463A-01.PDF; CONFIGURATION: Dual; COSS_TYP_PF: 13; CRSS_TYP_PF: 10; DATASHEET: http://www.onsemi.com/pub_link/Collateral/NTZD3154N-D.PDF; DATASHEET_VERSION: Rev. 2; FOOTPRINT_VARIANT_NAME_0: Manufacturer Recommended; ID_MAX_A: 0.54; IMPORTED: yes; IMPORTED_FROM: vault; IMPORT_TS: 1521848541; MF: On Semiconductor; MOUNTING_TECHNOLOGY: Surface Mount; MPN: NTZD3154NT1G; PACKAGE: SOT-563-6-463A-01; PACKAGE_DESCRIPTION: 6-Pin Small Outline Transistor, Body 1.6 x 1.2 mm, Pitch 0.5 mm; PACKAGE_TYPE: SOT-563; PACKAGE_VERSION: Rev. F, 04/2005; PACKING: Tape and Reel; PREFIX: Q; RELEASE_DATE: 1407165854; ROHS: No; VAULT_GUID: 95C2DCE6-FA9F-4449-8C15-0CE4E61BA86F; VAULT_REVISION: 0F9761EB-D948-4DFE-9DE5-C1E4B4AE69FF; VBRDSS_MIN_V: 20; VGSTH_MAX_V: 1; VGS_MAX_V: 6
R1-R9 R12 R13 = Kell Ideas:RESISTOR_SMD
RN1 RN2 = SparkFun-Resistors:1KOHM-ARRAY(4): 4 x 1kΩ resistor array A resistor is a passive two-terminal electrical component that implements electrical resistance as a circuit element. Resistors act to reduce current flow, and, at the same time, act to lower voltage levels within circuits. - Wikipedia An array is a collection of discrete resistors in a single package.; PROD_ID: RES-13020
SJ1 SJ2 = Kell Ideas:SOLDER_JUMPER: SMD solder JUMPER
SV1 = Kell Ideas:ML6: HARTING
SV2 = Kell Ideas:ML10: HARTING
SV3 = Kell Ideas:ML8
U1 = Kell Ideas:STM32F0XX: STM32F051 in LQPF48 package. STM32F0-series Cortex-M0 microcontroller in a 48 lead package. Datasheet <http://www.st.com/web/en/resource/technical/document/datasheet/DM00039193.pdf> (DM00039193.pdf) .; FLASH: 64K
U2 = Kell Ideas:EEPROM-I2C: I2C EEPROMs, 24LC256 and others 24LC256 Series 256 kb I2C 2 Wire (32 k x 8 Bit) 2.5 V Serial EEPROM SMD - SOIC-8 Datasheet SparkFun Products SparkFun UDB5 - PIC UAV Development Board <https://www.sparkfun.com/products/11703> (GPS-11703)
X1 = Kell Ideas:CONNECTOR_PHOENIX_3.81
X2 = Kell Ideas:CONNECTOR_PHOENIX: MKDS 1/ 8-3,5 Printklemme Nennstrom: 10 A Bemessungsspannung: 160 V Raster: 3,5 mm Polzahl: 8 Montageart: Löten Anschlussart: Schraubanschluss Anschlussrichtung vom Leiter zur Platine: 0° Source: http://eshop.phoenixcontact.com .. .pdf
Y1 = Kell Ideas:CRYSTAL: Crystals (Generic) These are passive quartz crystals, which can be used as a clock source for a microcontroller. Crystal's are two-terminal devices. They require external "load" capacitors to generate an oscillating signal.; LINK: YIC 49SLMT 8.00MHZ 20PF 30PPM

## Net classes
0 NET_SIGNAL: width 0.152 mm, drill 0.3 mm, clearance 0.152 mm
1 NET_POWER: width 1.016 mm, drill 0.5 mm, clearance 0.152 mm
3 NET_POWER_SMALL: width 0.254 mm, drill 0.4 mm, clearance 0.152 mm

## Board
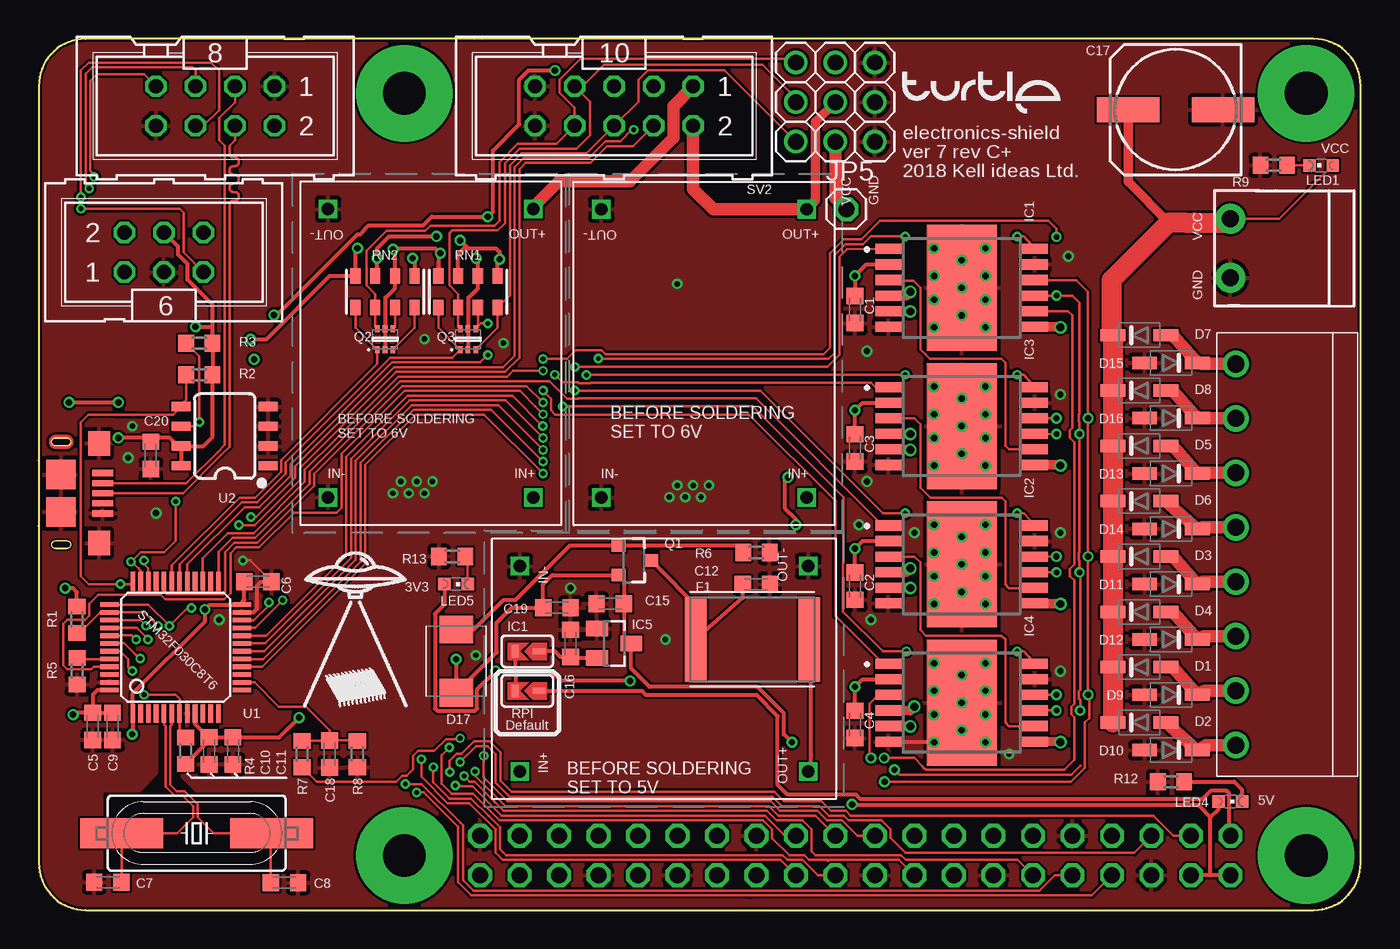
[diagram p8: board, top side]
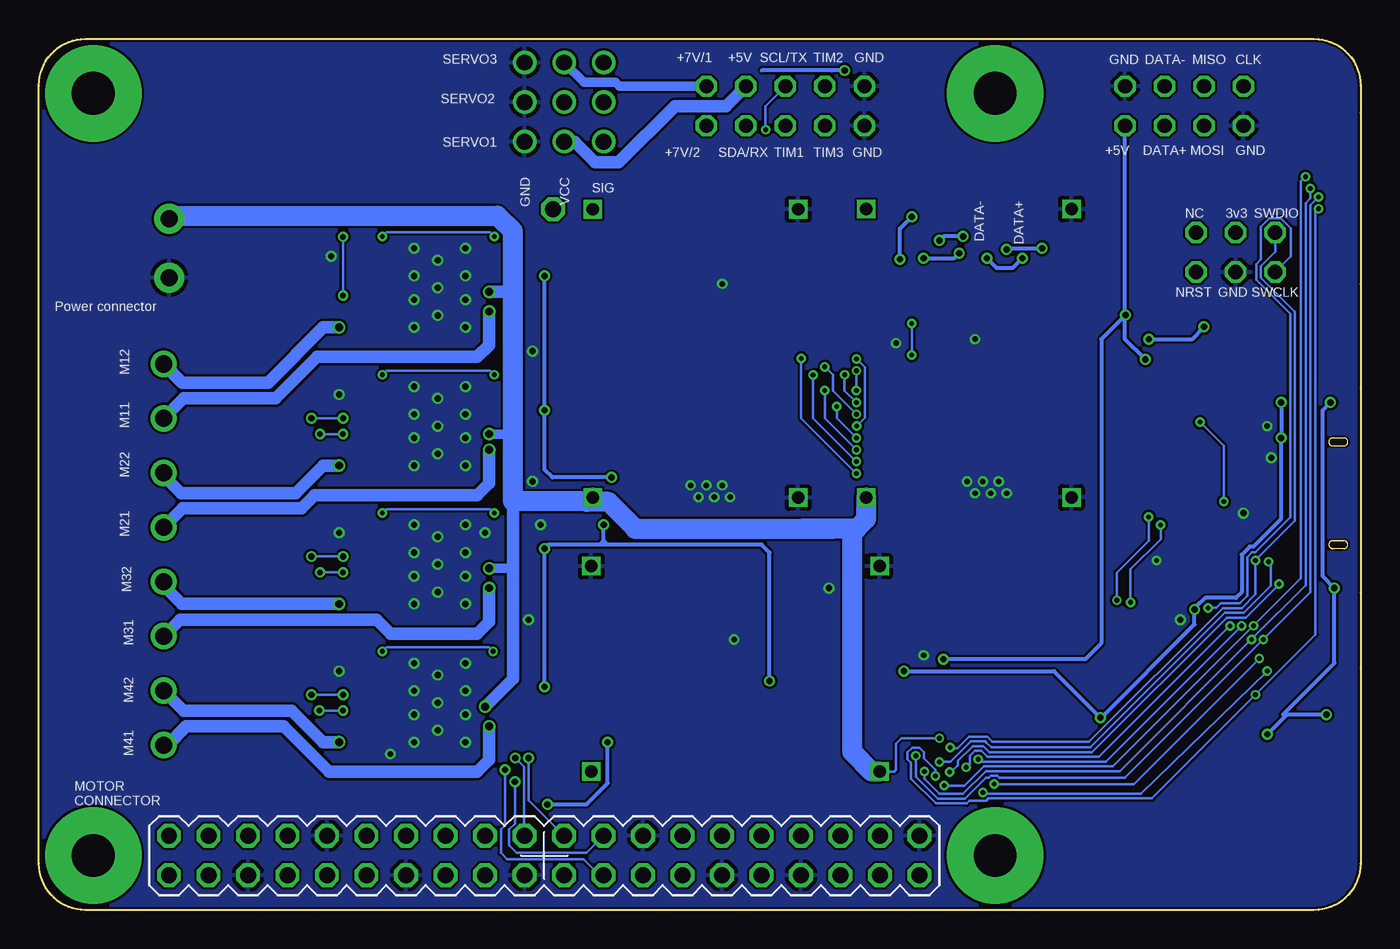
[diagram p9: board, bottom side, seen from below]

Size 85 x 56 mm. Coordinates in mm from the lower left corner, seen from the top.
Copper layers (1+16): Top 0.035mm / dielectric 1.5mm / Bottom 0.035mm
Design rules "default *": minimum track width 6mil, minimum drill 0.3mm, track to track 6mil, track to pad 6mil, pad to pad 6mil, via to via 6mil, smd to smd 6mil, copper to edge 6mil, drill to drill 6mil, minimum pad ring 6mil, minimum via ring 6mil, stop-mask expansion 4mil, vias tented up to drill 0.5mm, thermal gap 10mil
tRestrict: area 4.2,2.4 to 15.9,13.6

### Footprints (pad centres in the part's own frame; a part is rotated, then mirrored left to right if it is on the bottom)
C0603K = smd 1.05 x 1.08: 1 -0.875,0; 2 0.875,0
FI8_6.2 = smd 4 x 1.6: + 3.05,0; - -3.05,0
SOD123 = smd 1.6 x 0.8: 1 -1.7,0; 2 1.7,0
SMBJ = smd 1.78 x 2.16: A 2.04,0; C -2.03,0
FUSC7351X125 = smd 1.388 x 5.45: 1 -3.649,0; 2 3.649,0
PG-DSO-12-9 = smd 0.65 x 1.67: 1 -2.5,-4.7; 2 -1.5,-4.7; 3 -0.5,-4.7; 4 0.5,-4.7; 5 1.5,-4.7; 6 2.5,-4.7; 7 2.5,4.7; 8 1.5,4.7; 9 0.5,4.7; 10 -0.5,4.7; 11 -1.5,4.7; 12 -2.5,4.7 | smd 8.1 x 4.5: 13 0,0
LINEAR_SOT23 = smd 1 x 1.4: 1 -0.95,-1.1; 2 0.95,-1.1; 3 0,1.1
DC-BRICK = drill 0.8 square: IN1+1 1.778,1.778; IN1-1 1.778,14.986; OUT1+1 20.32,1.778; OUT1-1 20.32,14.986
USB-MICRO-B = smd 0.4 x 1.35: D+ 0,2.675; D- -0.65,2.675; GND 1.3,2.675; ID 0.65,2.675; VCC -1.3,2.675 | smd 1.6 x 1.4: SHIELD$1 -3.2,2.45; SHIELD$2 3.2,2.45 | smd 1.9 x 1.9: SHIELD$3 -1.2,0; SHIELD$4 1.2,0
1X03_ROUND_DNP = drill 1.016: 1 -2.54,0; 2 0,0; 3 2.54,0
1X01 = drill 1.016 octagon: 1 0,0
CHIPLED_0603 = smd 0.8 x 0.8: A 0,-0.75; C 0,0.75
RASPBERRY_PI_B+_CONNECTOR = drill 1.016 octagon: 1 8.37,51.23; 2 8.37,53.77; 3 10.91,51.23; 4 10.91,53.77; 5 13.45,51.23; 6 13.45,53.77; 7 15.99,51.23; 8 15.99,53.77; 9 18.53,51.23; 10 18.53,53.77; 11 21.07,51.23; 12 21.07,53.77; 13 23.61,51.23; 14 23.61,53.77; 15 26.15,51.23; 16 26.15,53.77; 17 28.69,51.23; 18 28.69,53.77; 19 31.23,51.23; 20 31.23,53.77; 21 33.77,51.23; 22 33.77,53.77; 23 36.31,51.23; 24 36.31,53.77; 25 38.85,51.23; 26 38.85,53.77; 27 41.39,51.23; 28 41.39,53.77; 29 43.93,51.23; 30 43.93,53.77; 31 46.47,51.23; 32 46.47,53.77; 33 49.01,51.23; 34 49.01,53.77; 35 51.55,51.23; 36 51.55,53.77; 37 54.09,51.23; 38 54.09,53.77; 39 56.63,51.23; 40 56.63,53.77 | drill 2.75 pad 6.2: PE_BL 3.5,3.5; PE_BR 61.5,3.5; PE_TL 3.5,52.5; PE_TR 61.5,52.5
USER-SUBMITTED_SOT23-3 = smd 0.8 x 0.9: 1 -0.95,-1; 2 0.95,-1; 3 0,1.1
ON-SEMICONDUCTOR---NTZD3154NT1G_ON_SEMICONDUCTOR_NTZD3154NT1G_0 = smd 0.45 x 0.3: 1 -0.675,0.5; 2 -0.675,0; 3 -0.675,-0.5; 4 0.675,-0.5; 5 0.675,0; 6 0.675,0.5
R0603 = smd 1 x 1.1: 1 -0.85,0; 2 0.85,0
0805-ARV = smd 0.65 x 1: 1 -1.905,-1; 2 -0.635,-1; 3 0.635,-1; 4 1.905,-1; 5 1.905,1; 6 0.635,1; 7 -0.635,1; 8 -1.905,1
SJ = smd 0.406 x 0.813: 1 -0.762,0 | smd 0.813 x 0.406: 2 0.762,0
ML6 = drill 0.914 octagon: 1 -2.54,-1.27; 2 -2.54,1.27; 3 0,-1.27; 4 0,1.27; 5 2.54,-1.27; 6 2.54,1.27
ML10 = drill 0.914 octagon: 1 -5.08,-1.27; 2 -5.08,1.27; 3 -2.54,-1.27; 4 -2.54,1.27; 5 0,-1.27; 6 0,1.27; 7 2.54,-1.27; 8 2.54,1.27; 9 5.08,-1.27; 10 5.08,1.27
ML8 = drill 0.914 octagon: 1 -3.81,-1.27; 2 -3.81,1.27; 3 -1.27,-1.27; 4 -1.27,1.27; 5 1.27,-1.27; 6 1.27,1.27; 7 3.81,-1.27; 8 3.81,1.27
LQFP48 = smd 0.3 x 1.2: 1 -2.75,-4.25; 2 -2.25,-4.25; 3 -1.75,-4.25; 4 -1.25,-4.25; 5 -0.75,-4.25; 6 -0.25,-4.25; 7 0.25,-4.25; 8 0.75,-4.25; 9 1.25,-4.25; 10 1.75,-4.25; 11 2.25,-4.25; 12 2.75,-4.25; 25 2.75,4.25; 26 2.25,4.25; 27 1.75,4.25; 28 1.25,4.25; 29 0.75,4.25; 30 0.25,4.25; 31 -0.25,4.25; 32 -0.75,4.25; 33 -1.25,4.25; 34 -1.75,4.25; 35 -2.25,4.25; 36 -2.75,4.25 | smd 1.2 x 0.3: 13 4.25,-2.75; 14 4.25,-2.25; 15 4.25,-1.75; 16 4.25,-1.25; 17 4.25,-0.75; 18 4.25,-0.25; 19 4.25,0.25; 20 4.25,0.75; 21 4.25,1.25; 22 4.25,1.75; 23 4.25,2.25; 24 4.25,2.75; 37 -4.25,2.75; 38 -4.25,2.25; 39 -4.25,1.75; 40 -4.25,1.25; 41 -4.25,0.75; 42 -4.25,0.25; 43 -4.25,-0.25; 44 -4.25,-0.75; 45 -4.25,-1.25; 46 -4.25,-1.75; 47 -4.25,-2.25; 48 -4.25,-2.75
SO-08 = smd 0.6 x 1.2: 1 -1.905,-2.8; 2 -0.635,-2.8; 3 0.635,-2.8; 4 1.905,-2.8; 5 1.905,2.8; 6 0.635,2.8; 7 -0.635,2.8; 8 -1.905,2.8
3.81MM_2PIN = drill 1.1 pad 1.93: 1 -5.715,0; 2 -1.905,0
3.5MM_8PIN = drill 1.1 pad 1.7: 1 -12.25,-0.1; 2 -8.75,-0.1; 3 -5.25,-0.1; 4 -1.75,-0.1; 5 1.75,-0.1; 6 5.25,-0.1; 7 8.75,-0.1; 8 12.25,-0.1
HC49UP = smd 5.334 x 1.93: 1 -4.826,0; 2 4.826,0

### Placement (x,y rotation side)
C1  52.49,38.6 270 top
C2  52.49,20.82 270 top
C3  52.49,29.71 270 top
C4  52.49,11.93 270 top
C5  3.47,11.8 270 top
C6  14.08,21.1 0 top
C7  4.44,1.78 0 top
C8  15.79,1.75 180 top
C9  4.74,11.8 270 top
C10  10.96,10.23 270 top
C11  12.48,10.23 270 top
C12  46.14,20.95 0 top
C15  36.74,19.68 180 top
C16  34.2,17.14 90 top
C17  73.1,51.45 180 top
C18  18.71,10.03 270 top
C19  33.31,19.42 0 top
C20  7.2,29.23 270 top
D1  70.78,15.61 0 top
D2  70.78,12.06 0 top
D3  70.78,22.73 0 top
D4  70.78,19.17 0 top
D5  70.78,29.84 0 top
D6  70.78,26.28 0 top
D7  70.78,36.95 0 top
D8  70.78,33.39 0 top
D9  72.81,13.84 180 top
D10  72.81,10.28 180 top
D11  72.81,20.95 180 top
D12  72.81,17.39 180 top
D13  72.81,28.06 180 top
D14  72.81,24.5 180 top
D15  72.81,35.17 180 top
D16  72.81,31.62 180 top
D17  26.83,16 90 top
F1  45.88,17.39 0 top
IC1  59.35,40 270 top
IC2  59.35,22.22 270 top
IC3  59.35,31.11 270 top
IC4  59.35,13.33 270 top
IC5  36.99,17.14 270 top
IC6  29.16,7.12 0 top
IC7  33.58,24.74 90 top
IC8  51.16,24.73 90 top
J1  1.43,26.79 270 top
JP1  51.22,49.4 0 top
JP2  51.22,51.94 0 top
JP3  51.22,54.48 0 top
JP5  51.93,45.05 0 top
LED1  82.46,47.87 90 top
LED4  76.62,6.98 270 top
LED5  26.83,20.95 270 top
PCB1  85,56 180 top
Q1  38.26,22.47 270 top
Q2  22.26,36.7 90 top
Q3  27.6,36.7 90 top
R1  2.45,18.66 90 top
R2  10.32,34.41 0 top
R3  10.32,36.44 0 top
R4  9.43,10.23 270 top
R5  2.47,15.36 90 top
R6  46.14,22.98 180 top
R7  16.93,10.03 270 top
R8  20.48,10.03 90 top
R9  79.41,47.87 180 top
R12  72.81,8.25 180 top
R13  26.58,22.73 180 top
RN1  27.6,39.74 0 top
RN2  22.26,39.74 0 top
SJ1  31.41,16.63 0 top
SJ2  31.41,14.09 0 top
SV1  8.04,42.28 0 top
SV2  36.99,51.68 180 top
SV3  11.34,51.68 180 top
U1  8.8,16.88 0 top
U2  11.95,30.46 90 top
X1  76.62,46.35 90 top
X2  76.87,22.85 90 top
Y1  10.15,4.94 180 top

### Tracks (layer width: path | path; a pad name or v marks a point on that pad's centre or on a via)
3V3_RPI
  Top 0.254: SJ2.2 38.77,14.09 39.03,13.84 46.14,13.84 47.51,12.46 47.51,8.06 48.15,7.42 52.56,7.42 52.85,7.13 74.83,7.13 75.35,7.66 76.38,7.66 76.55,7.49 76.55,4.85 PCB1.1
3V3_STABILIZED
  Top 0.254: IC5.2 34.27,16.19 C16.1 33.55,16.26 33.18,16.63 SJ1.2
5V_NOT_TRIMMED
  Top 0.254: C12.1 45.26,20.07 F1.1 42.58,19.25 Q1.3
+3V3  (via drill 0.4)
  Top 0.254: R4.2 10.96,10.9 C10.1 | C10.1 C11.1 15.47,11.1 v16.73,12.37 | C10.1 10.56,11.5 10.5,11.5 10.05,11.95 U1.9 | C6.1 13.21,19.93 12.91,19.63 | C5.1 C9.1 | U1.48 3.76,14.13 3.47,13.84 C5.1 | 6,12.68 U1.1 | U1.1 6.05,11.34 v6.01,11.3 | v1.69,20.69 2.2,20.69 2.45,20.44 R1.2 | U1.1 6.05,13.94 10.68,18.57 v10.68,19.32 10.97,19.61 12.58,19.61 12.61,19.63 12.91,19.63 | C5.1 2.31,12.68 v2.2,12.57 | 12.91,19.63 U1.24 | U2.7 U2.8 | 11.17,37.46 R3.2 R2.2 11.17,30.43 10.57,29.83 U2.7 | 11.17,37.46 11.17,38.89 9.56,40.51 9.56,41.53 8.95,42.14 8.95,42.64 SV1.4 | v1.94,32.63 v5.11,32.63 | U2.7 8.93,29.83 8.42,30.35 7.02,30.35 | 7.02,30.35 v5.11,30.35 | C20.1 7.02,30.26 7.02,30.35 | 30.64,15.36 SJ2.1 | C3.1 v52.49,32.12 52.97,32.61 IC3.2 | C4.1 v52.49,14.34 52.97,14.83 IC4.2 | IC2.2 52.97,23.72 v52.49,23.23 C2.1 | v48.68,24.76 48.68,25.11 47.99,25.79 47.99,27.63 v48.17,27.81 | C1.1 v52.49,40.76 53.23,41.5 IC1.2 | v10.07,37.5 11.13,37.5 11.17,37.46 | 30.64,15.36 30.39,15.36 30.14,15.36 v29.37,15.36 28.19,14.18 28.19,12.96 28.03,12.8 25.64,12.8 25.47,12.96 25.47,19.04 26.08,19.65 LED5.A | 30.64,15.36 SJ1.1 | v38.01,14.72 33.57,14.72 32.93,15.36 30.64,15.36 | Q3.2 Q3.5 27.63,37.4 27.63,39.36 28.23,39.96 RN1.6 28.23,41.78 v28.1,41.91 | Q2.2 Q2.5 22.29,37.4 22.29,39.36 22.9,39.96 RN2.6 22.9,42.41 23.02,42.54 | RN1.8 25.69,41.01 | 25.69,41.01 25.69,41.65 | v20.48,42.54 20.36,42.41 RN2.8 20.34,40.76 18.71,40.76 14.64,36.7 v13.63,36.7 | 25.69,41.01 25.69,42.08 v25.82,42.21 25.49,42.54 23.02,42.54 | 23.02,42.54 22.95,42.46 v22.77,42.46
  Bottom 0.254: v6.01,11.3 4.74,12.57 | v29.37,15.36 19.72,15.36 v16.73,12.37 16.7,12.34 10.68,18.36 v10.68,19.32 10.81,19.45 10.62,19.45 9.99,20.07 8.02,20.07 7.65,20.44 7.65,22.84 7.13,23.36 6.91,23.36 5.11,25.16 v5.11,30.35 v5.11,32.63 4.99,32.63 | 4.74,12.57 4.99,12.57 1.69,15.87 v1.69,20.69 2.45,21.46 2.45,32.12 v1.94,32.63 | v38.01,14.72 38.01,22.98 38.52,23.49 48.42,23.49 | 48.68,23.49 48.93,23.49 | 48.93,23.49 52.23,23.49 v52.49,23.23 v52.49,14.34 | 48.68,23.49 48.68,23.74 | 48.68,23.74 v48.68,24.76 | v52.49,40.76 v52.49,32.12 52.49,28.31 51.98,27.81 v48.17,27.81 | 48.42,23.49 48.68,23.49 | 48.42,23.49 48.68,23.74 | 48.68,23.74 48.93,23.49 | v13.63,36.7 10.83,36.7 10.07,37.46 v10.07,37.5 | v2.2,12.57 4.74,12.57 | v22.77,42.46 22.7,42.54 v20.48,42.54 | v28.1,41.91 26.12,41.91 v25.82,42.21
+5V  (via drill 0.4)
  Top 0.254: 26.59,13.72 D17.C | D17.C 29.44,16.57 29.44,18.47 30.39,19.42 C19.1 32.44,20.95 33.01,21.52 Q1.2 37.61,21.17 C15.1 37.61,17.62 IC5.3 38.09,15.53 39.28,14.34 46.2,14.34 47.91,12.63 47.91,11.3 v48.42,10.79 | v33.18,53.97 33.17,53.98 31.49,53.98 30.88,53.38 30.88,50.5 29.2,48.81 29.2,48.38 29.2,44.9 v28.87,44.57 25.25,44.57 24.7,44.01 21.2,44.01 20.61,43.42 20.48,43.42 15.3,38.25 v15.12,38.25 | PCB1.2 75.35,2.23 | 75.35,2.23 PCB1.4 | 75.35,5.96 74.59,6.72 52.36,6.72 v52.3,6.79 | v26.83,16.12 D17.C | 75.35,2.23 75.35,5.96 | 75.35,5.96 75.87,6.48 LED4.A | RN1.5 29.5,41.71 v29.63,41.83 29.63,42.28 29.37,42.54 27.34,42.54 | RN2.7 21.75,40.87 v21.75,41.91 21.75,42.54 22.52,43.3 v25.56,43.3 | v24.04,41.91 24.17,41.78 RN2.5 | RN1.7 26.96,42.16 27.34,42.54 | v27.09,43.05 27.6,42.54 27.34,42.54
  Bottom 0.254: 15.15,38.22 SV3.2 | 15.15,38.22 v15.12,38.25 16.67,36.7 16.67,17.14 17.69,16.12 v26.83,16.12 | v33.18,53.97 34.01,53.97 34.03,53.98 38.5,53.98 | v13.85,35.4 15.15,36.7 15.15,38.22 | v52.3,6.79 49.8,6.79 48.42,8.16 v48.42,10.79 | v28.87,44.57 29.63,43.81 v29.63,41.83 | v21.75,41.91 22.39,41.27 23.4,41.27 v24.04,41.91 | v25.56,43.3 26.83,43.3 v27.09,43.05
+5V/2
  Top 0.813: JP5.1 51.22,45.76 JP1.2
  Bottom 0.813: SV2.3 40.8,51.68 44.11,51.68 47.71,48.08 49.22,48.08 50.55,49.4 JP1.2
+5V_RAW
  Top 0.152: IC6.OUT1+1 49.52,8.9 49.66,8.76
  Top 0.254: 49.66,9.92 49.66,10.03 | 49.66,10.03 49.66,16.92 F1.2 | 49.66,8.52 49.66,8.76 49.66,10.03
+7V/1
  Top 0.813: SV2.1 40.8,51.68 40.8,49.65 38.01,46.86 33.44,46.86 31.8,45.22 IC7.OUT1+1
  Bottom 0.61: SV2.1 47.66,52.95 47.92,53.21 49.95,53.21 JP3.2
+7V/2
  Top 0.61: IC8.OUT1+1 49.95,45.62 49.95,50.67 JP2.2
  Top 0.813: IC8.OUT1+1 43.37,45.05 42.07,46.35 SV2.2
BAT_MEAS
  Top 0.152: U1.14 13.87,14.63 15.43,13.07 17.18,13.07 18.71,11.55 C18.1 | R7.1 18.68,10.88 C18.1 | C18.1 20.46,10.9 R8.2
BOOT0
  Top 0.152: U1.44 2.54,16.13 R5.2
D1-R3
  Top 0.254: R6.2 44.85,23.42 Q1.1 34.13,23.42 30.64,19.93 29.88,19.93 27.98,18.04 D17.A
DATA_N
  Top 0.152: 9.49,27.44 9.58,27.53 | 9.58,27.53 11.49,29.44 11.95,29.9 11.95,42.28 11.95,45.6 11.95,49.14 11.59,49.5 11.59,50.92 12.61,51.94 SV3.3 | J1.D- 9.49,27.44 | 9.49,27.44 9.58,27.53
DATA_P
  Top 0.152: SV3.4 12.61,49.5 12.25,49.14 12.25,48.89 12.25,48.64 arc90 12.52,48.38 12.6,48.38 arc-90 12.86,48.11 12.86,48.09 arc-90 12.6,47.82 12.52,47.82 arc90 12.25,47.55 12.25,47.53 arc90 12.52,47.27 12.6,47.27 arc-90 12.86,47 12.86,46.98 arc-90 12.6,46.71 12.52,46.71 arc90 12.25,46.44 12.25,46.42 arc90 12.52,46.15 12.6,46.15 arc-90 12.86,45.89 12.86,45.87 arc-90 12.6,45.6 12.52,45.6 arc90 12.25,45.33 12.25,29.77 11.7,29.22 9.27,26.79 J1.D+
EN1  (via drill 0.3)
  Top 0.152: v55.72,43.3 53.5,43.3 53,42.8 52.49,42.8 51.86,42.8 51.26,42.2 51.17,42.11 51.17,35.81 50.79,35.43 35.98,35.43 v35.98,35.45 | v62.9,43.3 63.33,43.3 IC1.12 | v32.42,28.06 32.42,28.07 28.65,31.85 24.22,31.85 20.99,28.62 20.99,22.27 18.7,19.98 14.35,15.63 U1.16
  Bottom 0.152: v35.98,35.45 35.98,31.62 v32.42,28.06 | v62.9,43.3 62.65,43.55 55.97,43.55 v55.72,43.3
EN2  (via drill 0.3)
  Top 0.152: v35.22,34.39 35.24,34.41 v55.72,34.41 | v62.9,34.41 63.33,34.41 IC3.12 | v32.42,28.82 29.09,32.15 24.09,32.15 20.69,28.75 20.69,22.4 14.42,16.13 U1.17
  Bottom 0.152: v35.22,34.39 35.22,31.62 v32.42,28.82 | v62.9,34.41 62.65,34.66 55.97,34.66 v55.72,34.41
EN3  (via drill 0.3)
  Top 0.152: v55.72,25.52 54.27,25.52 46.39,33.39 v34.45,33.39 | v62.9,25.52 63.33,25.52 IC2.12 | v32.42,29.58 29.55,32.46 23.96,32.46 20.38,28.87 20.38,22.52 14.49,16.63 U1.18 13.62,16.63
  Bottom 0.152: v34.45,33.39 34.45,31.62 v32.42,29.58 | v62.9,25.52 62.65,25.77 55.97,25.77 v55.72,25.52
EN4  (via drill 0.3)
  Top 0.152: 55.97,16.63 v55.79,16.63 54.27,16.63 51.72,19.18 51.72,22.32 51.73,22.32 51.73,26.54 45.88,32.38 v33.69,32.38 | v62.9,16.63 63.33,16.63 IC4.12 | v32.42,30.35 30.01,32.76 23.84,32.76 20.08,29 20.08,22.65 14.56,17.14 U1.19
  Bottom 0.152: v32.42,30.35 33.69,31.62 v33.69,32.38 | v62.9,16.63 62.65,16.88 56.04,16.88 v55.79,16.63
GND  (via drill 0.3, 0.35, 0.4)
  Top 0.152: C6.2 13.59,22.47 v13.12,22.47
  Top 0.254: C6.2 14.29,21.1 14.01,20.83 14.01,19.36 13.79,19.13 U1.23 | IC4.6 58.04,10.83 58.08,10.79 v57.57,10.79
  other vias: 11.59,18.66 34.2,20.69 5.75,29.08 7.53,25.52 65.7,24.25 65.7,33.14 66.2,42.03 65.7,15.36 57.57,15.87 57.57,14.09 57.57,12.57 59.35,15.11 60.87,15.87 60.87,14.09 60.87,12.57 60.87,10.79 59.35,13.33 59.35,11.55 59.35,22.22 53.25,35.93 53.25,27.55 52.74,24.76 56.3,24.25 53.5,18.66 57.57,24.76 57.57,22.98 57.57,19.68 57.57,21.46 59.35,24 60.87,24.76 60.87,22.98 60.87,21.46 60.87,19.68 59.35,20.44 57.57,33.65 57.57,31.87 57.57,28.57 57.57,30.35 59.35,32.89 60.87,33.65 60.87,31.87 60.87,30.35 60.87,28.57 59.35,31.11 59.35,29.33 57.57,42.54 57.57,40.76 57.57,37.46 57.57,39.24 59.35,41.78 60.87,42.54 60.87,40.76 60.87,39.24 60.87,37.46 59.35,40 59.35,38.22 22.77,26.79 23.79,26.79 24.8,26.79 25.31,27.55 24.29,27.55 23.28,27.55 40.55,26.54 41.57,26.54 42.58,26.54 43.09,27.3 42.07,27.3 41.06,27.3 6.01,31.11 40.3,17.39 41.06,40.25 24.8,36.7 29.88,36.44 28.1,16.38 62.39,10.03
  pour Bottom: -5.17,60.57 91.35,60.57 91.35,-5.21 -5.17,-5.21
  pour Top: -7.71,63.37 93.89,63.37 93.89,-7.75 -7.71,-7.75
IN11  (via drill 0.3)
  Top 0.152: IC1.1 51.98,42.49 51.47,41.98 51.47,35.68 50.71,34.92 v34.45,34.92 | U1.45 3.52,15.63 3.36,15.48 1.82,15.48 1.56,15.74 1.56,18.41 1.81,18.66 2.97,18.66 3.23,18.92 3.23,19.68 3.81,20.26 7.84,20.26 8.14,19.96 11.93,19.96 12.32,20.36 12.32,22.94 12.7,23.31 14.18,23.31 16.4,25.54 19.14,25.54 19.47,25.87 19.47,29.33 23.51,33.37 30.93,33.37 31.91,32.39 31.91,32.38 v32.42,31.87
  Bottom 0.152: v34.45,34.92 33.95,34.41 33.95,33.64 33.92,33.61 33.92,33.37 v32.42,31.87
IN21  (via drill 0.3)
  Top 0.152: IC3.1 53.81,33.6 53.5,33.9 35.48,33.9 35.44,33.86 34.74,33.86 34.67,33.92 33.67,33.92 v33.18,34.41 | v32.42,32.63 31.38,33.68 23.35,33.68 17.71,28.04 17.71,27.28 14.05,23.62 12.57,23.62 11.97,23.01 11.97,20.44 11.83,20.3 8.26,20.3 8.05,20.52 U1.32
  Bottom 0.152: v33.18,34.41 33.18,33.39 v32.42,32.63
IN31
  Top 0.152: IC2.1 54.29,24.71 46.11,32.89 34.7,32.89 34.67,32.86 33.96,32.86 32.84,33.98 23.23,33.98 17.41,28.16 17.41,27.41 13.92,23.92 12.45,23.92 11.55,23.02 U1.25
IN41  (via drill 0.3)
  Top 0.152: IC4.1 54.32,15.82 51.22,18.92 51.22,26.29 45.64,31.87 45.62,31.85 33.21,31.85 32.93,32.12 32.93,32.39 32.95,32.41 32.95,32.85 v32.43,33.38 v32.43,33.39 | 10.55,21.73 U1.27 10.55,22.63 12.15,24.23 13.8,24.23 17.1,27.53 17.1,28.29 19.06,30.25 23.1,34.28 30.11,34.28 30.49,34.66 v32.42,34.66
  Bottom 0.152: v32.43,33.39 v32.43,34.66 v32.42,34.66
MOT11  (via drill 0.5)
  Top 0.61: IC1.5 56.02,38.5 v56.04,38.47
  Top 0.813: X2.7 D16.1 72.93,33.39 D8.2
  Bottom 0.813: X2.7 75.69,32.89 69.76,32.89 67.09,35.55 56.81,35.55 56.04,36.31 v56.04,38.47
MOT12  (via drill 0.5)
  Top 0.61: IC1.7 65.64,37.51 v65.7,37.46
  Top 0.813: X2.8 74.78,35.1 D15.1 72.93,36.95 D7.2
  Bottom 0.813: X2.8 75.77,33.9 70.27,33.9 66.71,37.46 v65.7,37.46
MOT21  (via drill 0.5)
  Top 0.61: IC3.5 54.57,29.58 v56.04,29.58
  Top 0.813: X2.5 74.81,24.6 D14.1 74.45,24.5 D6.2
  Bottom 0.813: v56.04,29.58 56.04,27.43 56.81,26.66 67.25,26.66 68.09,25.82 75.75,25.82 X2.5
MOT22  (via drill 0.5)
  Top 0.61: IC3.7 65.64,28.62 v65.7,28.57
  Top 0.813: X2.6 74.75,28.1 D13.1 72.93,29.84 D5.2
  Bottom 0.61: X2.6 76.97,27.91
  Bottom 0.813: 76.97,27.91 75.86,26.79 68.49,26.79 66.71,28.57 v65.7,28.57
MOT31  (via drill 0.5)
  Top 0.61: IC2.5 56.02,20.72 v56.04,20.69
  Top 0.813: X2.3 74.92,17.6 D12.1 72.93,19.17 D4.2
  Bottom 0.813: X2.3 75.91,18.66 63.28,18.66 62.39,17.77 56.81,17.77 56.04,18.54 v56.04,20.69
MOT32  (via drill 0.5)
  Top 0.61: IC2.7 64.2,19.68 v65.7,19.68
  Top 0.813: X2.4 74.86,21.1 D11.1 72.93,22.73 D3.2
  Bottom 0.61: 76.97,20.85 X2.4
  Bottom 0.813: v65.7,19.68 75.8,19.68 76.97,20.85
MOT41  (via drill 0.5)
  Top 0.61: IC4.5 56.02,11.83 v56.04,11.8
  Top 0.813: X2.1 75.03,10.6 D10.1 74.45,10.28 D2.2
  Bottom 0.61: X2.1 76.72,10.6
  Bottom 0.813: 76.72,10.6 75.52,11.8 69.25,11.8 66.33,8.88 56.81,8.88 56.04,9.64 v56.04,11.8
MOT42  (via drill 0.5)
  Top 0.61: IC4.7 65.64,10.84 v65.7,10.79
  Top 0.813: X2.2 74.97,14.1 D9.1 72.93,15.61 D1.2
  Bottom 0.813: X2.2 75.69,12.82 68.74,12.82 66.71,10.79 v65.7,10.79
N$1
  Top 0.152: LED1.C R9.1
N$4
  Top 0.254: R12.1 76.87,8.25 77.38,7.74 77.37,7.73 LED4.C
N$5
  Top 0.152: R13.1 27.58,22.57 LED5.C
N$14
  Top 0.152: Q2.4 22.9,37.51 RN2.3
N$16
  Top 0.152: RN2.4 24.17,37.43 Q2.3
NRST  (via drill 0.3)
  Top 0.152: R4.1 9.05,11.46 U1.7 9.05,13.59 8.93,13.71 8.8,13.84 v6.77,13.84 | PCB1.12 62.94,3.22 55.75,3.22 55.45,3.52 49.95,3.52 49.68,3.79 49.68,5.18 49.1,5.76 47.42,5.76 46.81,6.37 29.89,6.37 29.33,6.93 | 29.33,6.93 29.28,6.98 | v2.7,45.08 9.05,45.08 9.31,44.82 9.31,42.28 SV1.5 | 29.33,6.93 28.02,8.25 27.7,8.25 v27.34,8.61
  Bottom 0.152: 14.39,7.18 23.92,7.18 24.07,7.03 25.14,7.03 25.32,6.86 27.32,6.86 28.92,8.45 28.92,9.48 29.13,9.69 29.13,10.13 28.82,10.45 28.38,10.45 28.07,10.13 28.07,9.75 27.34,9.02 v27.34,8.61 | 14.39,7.18 14.13,7.18 | 14.39,7.18 14.14,7.18 14.01,7.18 13.42,7.18 v6.77,13.84 2.91,17.7 2.91,44.88 v2.7,45.08
OSCILATOR_N
  Top 0.152: U1.5 8.05,11.89 8.14,11.8 8.14,7.93 8.74,7.33 9.24,7.33 9.92,6.66 9.92,5.96 8.89,4.94 Y1.2 5.31,4.92 C7.2
OSCILATOR_P
  Top 0.152: 8.49,11.86 8.44,11.8 8.44,8.06 8.86,7.64 9.37,7.64 10.22,6.79 10.22,5.96 11.25,4.94 Y1.1 14.92,4.88 C8.2 | 8.49,11.86 8.55,11.91 U1.6 8.49,12.58 8.49,11.86
RPI_CLK  (via drill 0.3, 0.4)
  Top 0.152: PCB1.23 47.98,4.77 46.69,6.06 29.77,6.06 27.89,7.94 26.84,7.94 v26.78,8 | U1.39 6.53,18.63 v6.89,18.27 | v3.54,47.14 3.54,47.29 3.31,47.52 3.31,53.31 3.72,53.71 6.77,53.71 SV3.7 | IC1.10 66.72,40.5 67.47,39.74 v67.47,31.62 v67.47,22.73 v67.47,13.84 67.55,13.76 67.55,12.33 67.27,12.06 67.27,9.14 66.38,8.25 v54.39,8.25 | v65.44,31.62 IC3.10 | v65.44,22.73 IC2.10 | v65.44,13.84 v65.43,13.83 IC4.10
  Bottom 0.152: v26.78,8 25.47,8 24.23,9.23 15.93,9.23 v6.89,18.27 3.84,21.32 3.84,46.83 v3.54,47.14 | v67.47,31.62 v65.44,31.62 | v67.47,22.73 v65.44,22.73 | v67.47,13.84 v65.44,13.84 | PCB1.23 49.78,3.68 54.27,3.68 54.76,4.17 54.76,5.18 54.39,5.55 v54.39,8.25
RPI_MISO  (via drill 0.3, 0.4)
  Top 0.152: PCB1.21 49.93,6.06 47.55,6.06 46.94,6.67 30.02,6.67 28.05,8.64 v28.05,8.91 | U1.40 6.28,18.13 v7.02,17.39 | v3.23,46.38 3.01,46.61 3.01,53.77 3.41,54.17 9.87,54.17 10.07,53.97 SV3.5 | IC4.3 53.98,13.83 53.4,13.25 53.4,9.87 v53.5,9.77
  Bottom 0.152: v28.05,8.91 28.05,8.45 27.07,7.47 25.57,7.47 24.11,8.93 15.48,8.93 v7.02,17.39 3.54,20.87 3.54,45.44 3.23,45.74 v3.23,46.38 | v53.5,9.77 53.5,7.04 PCB1.21
RPI_MOSI  (via drill 0.3, 0.4)
  Top 0.152: PCB1.19 52.63,4.77 51.64,5.76 50.67,5.76 50.06,6.37 47.67,6.37 47.06,6.98 30.15,6.98 28.6,8.53 v28.6,9.91 | U1.41 5.24,17.63 5.28,17.67 5.98,17.67 v6.26,17.39 | v2.7,45.84 2.7,53.97 3.21,54.48 11.09,54.48 11.59,53.97 11.59,51.43 10.58,50.41 SV3.6 | IC1.8 66.18,38.5 66.46,38.22 66.46,30.99 66.31,30.84 66.31,30.36 66.59,30.08 66.59,22.23 66.31,21.95 66.31,21.47 66.59,21.19 66.59,13.26 66.38,13.06 66.38,12.58 66.59,12.38 66.59,9.65 65.95,9.01 57.04,9.01 56.87,9.18 56.87,9.2 56.3,9.77 v54.36,9.77
  Bottom 0.152: v28.6,9.91 28.61,9.9 28.61,8.58 27.2,7.17 25.44,7.17 24.11,8.5 23.91,8.5 23.78,8.62 23.34,8.62 23.22,8.5 15.15,8.5 v6.26,17.39 3.23,20.42 3.23,45.31 v2.7,45.84 | v54.36,9.77 53.81,9.22 53.81,4.81 PCB1.19
RPI_RXD  (via drill 0.3)
  Top 0.152: PCB1.10 65.33,2.23 64.34,1.24 45.88,1.24 | 45.88,1.24 45.74,1.24 | 45.88,1.24 | 45.88,1.24 27.96,1.24 27.28,1.92 27.28,5.44 27.12,5.59 24.62,8.09 24.55,8.09 | U1.42 5.5,17.14 6.13,16.5 | v23.56,8.09 24.55,8.09 | 6.13,16.5 6.21,16.42 | v6.51,16.17 6.47,16.17 6.13,16.5 | 24.55,8.09
  Bottom 0.152: v23.56,8.09 15.15,8.09 14.59,8.09 v6.51,16.17
RPI_TXD  (via drill 0.3)
  Top 0.152: PCB1.8 67.72,0.93 45.88,0.93 | 45.88,0.93 45.61,0.93 | 45.88,0.93 27.8,0.93 26.95,1.78 26.95,5.34 24.72,7.56 v24.29,7.56 | 4.58,16.61 U1.43 5.24,16.63 5.75,16.12 5.75,15.61 v6.01,15.36
  Bottom 0.152: v24.29,7.56 24.22,7.49 14.13,7.49 v6.01,15.36
SCL  (via drill 0.3)
  Top 0.152: 6.41,21.96 6.46,21.91 | 6.46,21.91 6.55,21.82 U1.35 | PCB1.5 70.46,3.68 55.73,3.68 54.76,4.64 54.76,5.18 54.18,5.76 52.07,5.76 51.77,6.06 50.8,6.06 50.19,6.67 47.8,6.67 47.19,7.28 30.27,7.28 29.47,8.09 29.37,8.18 29.37,10.03 28.87,10.53 28.1,10.53 v27.09,9.52 | R3.1 10.32,35.59 10.32,33.14 | 10.32,33.14 10.32,32.89 | 10.32,33.14 v10.32,31.36 10.06,31.1 U2.6 | v8.8,26.26 8.8,23.74 8.06,23 6.54,23 v5.92,22.39 5.98,22.39 6.46,21.91
  Bottom 0.152: 23.1,10.46 23.09,10.45 23.02,10.45 | 23.02,10.45 17.39,10.45 8.74,19.11 7.52,19.11 5.77,20.85 5.77,22.24 v5.92,22.39 | 23.02,10.45 23.75,10.45 24.06,10.77 | 24.13,10.83 24.06,10.77 | v27.09,9.52 26.38,9.52 25.07,10.83 24.13,10.83 | 24.13,10.83 24.06,10.77 | v10.32,31.36 8.8,29.84 v8.8,26.26
SCL_TX  (via drill 0.3)
  Top 0.152: U1.21 13.9,18.13 v15.68,19.91 | v38.26,50.16 38.12,50.16 37.4,49.43 36.45,49.43 35.43,48.42 | 35.43,48.42 35.34,48.33 | 35.43,48.42 35.34,48.33 | 35.34,48.33 31.18,48.33 30.59,47.74 30.59,35.63 29.86,34.9 22.85,34.9 16.49,28.54 16.49,27.78 13.97,25.27 v13.63,25.27
  Bottom 0.152: v38.26,50.16 38.26,51.68 SV2.5 | v13.63,25.27 13.63,23.74 15.68,21.69 v15.68,19.91
SDA  (via drill 0.3)
  Top 0.152: PCB1.3 72.95,4.77 71.66,6.06 52.2,6.06 51.89,6.37 50.92,6.37 50.31,6.98 47.93,6.98 47.32,7.59 33.95,7.59 32.42,7.59 | 32.42,7.59 32.17,7.59 | v26.43,8.88 26.43,9.61 26.87,10.05 27.19,10.05 27.63,10.5 27.98,10.84 28.99,10.84 29.68,10.15 29.68,8.31 30.4,7.59 32.42,7.59 | U1.36 5.86,20.95 v5.24,20.95 3.21,20.95 2.7,21.46 2.7,31.36 3.19,31.85 6.26,31.85 | 9.05,32.37 9.04,32.37 9.31,32.63 | 9.05,32.37 U2.5 8.63,31.85 6.26,31.85 | R2.1 9.47,32.89 | 9.47,32.89 9.47,32.8 | 9.47,32.89 9.47,32.79 9.31,32.63 | 9.31,32.63 9.05,32.37 | 9.31,32.53 9.31,32.63 | 4.89,31.85 6.26,31.85
  Bottom 0.152: v5.24,20.95 7.39,18.8 8.62,18.8 17.27,10.15 23.87,10.15 24.25,10.53 24.94,10.53 25.89,9.58 25.89,9.31 26.33,8.88 v26.43,8.88
SDA_RX  (via drill 0.3)
  Top 0.152: U1.22 13.82,18.63 14.79,19.61 v14.79,19.78 | SV2.4 38.21,49.09 36.54,49.09 35.52,48.08 35.47,48.02 31.3,48.02 30.9,47.62 30.9,35.5 29.98,34.59 | 29.98,34.59 24.47,34.59 | 29.98,34.59 22.97,34.59 16.8,28.41 16.8,27.66 13.88,24.73 12.89,24.73 v12.86,24.76
  Bottom 0.152: v12.86,24.76 12.86,23.84 14.79,21.91 v14.79,19.78
SERVO1
  Top 0.152: JP1.1 44.11,53.97 39.17,53.97 38.55,53.36 38.55,51.97 SV2.6 35.22,48.63 31.05,48.63 30.29,47.87 30.29,40.51 30.29,39.53 RN1.4 29.5,37.43 Q3.3
SERVO1_UC  (via drill 0.3)
  Top 0.152: U1.29 9.55,22.22 13.23,25.89 14.17,25.89 16.19,27.91 16.19,28.67 22.72,35.2 26.58,35.2 28.1,35.2 28.39,35.2 v28.87,35.68 | RN1.3 28.23,37.51 Q3.4 28.44,37.71 v28.87,37.71
  Bottom 0.152: v28.87,37.71 v28.87,35.68 | v28.87,35.68
SERVO2
  Top 0.152: 48.45,52.42 46.52,54.35 36.36,54.35 34.96,52.95 SV2.7 35.43,51.97 35.43,49.79 34.58,48.94 30.93,48.94 29.98,48 29.98,44.16 29.5,43.68 26.58,43.68 26.41,43.51 26.41,40.15 26.96,39.6 RN1.2 26.96,37.51 Q3.6
  Top 0.254: JP2.1 48.68,52.19 48.45,52.42
SERVO2_UC
  Top 0.152: U1.30 9.05,22.22 13.03,26.2 14.05,26.2 15.88,28.04 15.88,28.79 22.59,35.51 26.58,35.51 Q3.1 | Q3.1 | Q3.1 25.69,37.43 RN1.1
SERVO3
  Top 0.152: JP3.1 48.42,54.73 34.83,54.73 33.47,53.37 33.47,52.55 34.45,51.57 SV2.8 33.29,49.24 31.41,49.24 30.8,49.24 29.63,48.07 29.63,44.32 29.3,43.99 25.18,43.99 24.84,43.66 22.36,43.66 21.07,42.37 21.07,40.15 21.63,39.6 RN2.2 21.63,37.51 Q2.6
SERVO3_UC
  Top 0.152: U1.31 8.55,22.15 12.9,26.5 13.92,26.5 15.58,28.16 15.58,28.92 21.76,35.1 Q2.1 20.36,37.43 RN2.1
SO1-SI3
  Top 0.152: 54.77,40.38 54.71,40.44 | 54.71,40.44 IC1.3 | 63.41,29.58 64.02,29.58 IC3.8 62.37,29.61 62.14,29.84 62.14,35.17 61.89,35.43 57.31,35.43 57.02,35.72 57,35.72 56.68,36.04 56.68,40 56.24,40.44 54.71,40.44
SO2-SI4
  Top 0.152: IC2.3 56.31,22.72 56.68,22.34 56.68,18.03 57.06,17.65 61.89,17.65 62.14,17.39 62.14,12.06 62.39,11.8 64.02,11.8 IC4.8
SO3-SI2
  Top 0.152: IC3.3 56.31,31.61 56.68,31.23 56.68,27.15 57.33,26.5 61.92,26.5 62.14,26.28 62.14,20.95 62.39,20.69 64.02,20.69 IC2.8
SPI1_NSS  (via drill 0.3, 0.4)
  Top 0.152: U1.38 3.94,19.13 2.7,17.9 2.45,17.9 R1.1 | PCB1.24 47.7,3.22 29.83,3.22 29.36,3.69 29.36,5.18 27.68,6.86 26.29,6.86 24.6,8.55 v24.6,9.69 | U1.38 | U1.38 6.78,19.13 v7.65,18.27 | 66.97,9.26 66.41,8.71 55.33,8.71 v55.03,9.01
  Bottom 0.152: v7.65,18.27 16.38,9.54 24.45,9.54 v24.6,9.69 | PCB1.24 48.94,2.23 49.98,3.27 54.88,3.27 55.28,3.68 55.28,5.2 55.03,5.45 v55.03,9.01
SWCLK  (via drill 0.3)
  Top 0.152: PCB1.22 50.09,2.23 49.1,3.22 48.13,3.22 47.83,3.52 46.65,3.52 | 46.65,3.52 45.99,3.52 | 46.65,3.52 30.03,3.52 29.66,3.89 29.66,5.31 28.94,6.03 | 28.94,6.03 28.91,6.06 | v25.36,9.18 25.36,8.22 26.42,7.17 27.81,7.17 28.94,6.03 | U1.37 7.03,19.63 v8.4,18.26 9.56,19.42 v9.82,19.42 | 28.94,6.03 | 28.94,6.03
  Bottom 0.152: v8.4,18.26 16.82,9.84 23.28,9.84 | 23.28,9.84 23.34,9.84 | 24.8,10.22 24.38,10.22 24,9.84 23.28,9.84 | 24.8,10.22 24.82,10.22 | v25.36,9.18 25.13,9.41 25.13,9.91 24.82,10.22 | 24.82,10.22 24.8,10.22 | SV1.1 4.48,42.03 4.48,42.79 4.48,43.83 5.12,44.47 5.88,44.47 6.41,43.93 6.41,41.82 6.72,41.52 6.72,40.51 4.53,38.33 4.53,25.24 6.77,23 6.99,23 7.3,22.69 7.3,20.2 7.78,19.71 9,19.71 9.29,19.42 v9.82,19.42
SWDIO  (via drill 0.3)
  Top 0.152: 50.72,3.17 50.77,3.17 50.82,3.22 51.47,3.22 | 51.47,3.22 55.32,3.22 PCB1.18 | 51.47,3.22 49.53,3.22 49.23,3.52 48.26,3.52 47.15,4.63 47.15,4.95 47.14,4.96 47.14,5.18 46.56,5.76 29.64,5.76 27.93,7.47 26.54,7.47 25.89,8.12 25.89,9.26 | U1.34 7.05,21.96 6.77,22.23 v6.77,22.47 | 25.89,9.26 25.89,9.4 | 25.89,9.26 25.89,9.94 v26.4,10.46
  Bottom 0.152: 22.77,10.8 17.47,10.8 8.87,19.41 7.64,19.41 6.77,20.29 v6.77,22.47 4.23,25.01 4.23,38.45 6.41,40.63 6.41,41.39 5.5,42.31 SV1.2 | 22.77,10.8 23.01,10.8 | 22.77,10.8 23.67,10.8 24,11.14 25.2,11.14 25.94,10.4 26.35,10.4 v26.4,10.46
TLE_NSS  (via drill 0.3, 0.35)
  Top 0.152: IC4.9 65.43,12.83 v65.44,12.82 | v66.97,12.82 66.97,13.52 66.89,13.59 66.89,14.08 66.97,14.15 66.97,21.66 v66.92,21.71 66.92,22.46 66.89,22.48 66.89,22.97 66.92,22.99 v66.92,30.6 66.92,31.35 66.89,31.38 66.89,31.86 66.92,31.88 66.92,39.03 66.45,39.5 v65.44,39.5 IC1.9 | v65.44,21.71 IC2.9 | v65.44,30.6 IC3.9 | v65.44,43.27 65.44,43.81 64.93,44.32 54.09,44.32 52.91,43.13 51.76,43.13 50.86,42.23 50.86,42.1 50.86,36.14 50.46,35.73 36.45,35.73 36.2,35.98 34.5,35.98 33.97,35.45 32.44,35.45 v32.42,35.43 | v32.41,31.11 30.45,33.07 23.71,33.07 19.77,29.13 19.77,22.78 14.63,17.63 U1.20
  Bottom 0.152: v65.44,12.82 v66.97,12.82 | v66.92,21.71 v65.44,21.71 | v66.92,30.6 v65.44,30.6 | v65.44,39.5 v65.44,43.27 | v32.41,31.11 32.41,31.13 31.89,31.65 31.89,34.9 v32.42,35.43
VCC  (via drill 0.3, 0.5)
  Top 0.152: R7.2 17.86,8.25 22.97,8.25 23.34,8.62 23.65,8.62 24.07,9.04 24.07,9.91 24.38,10.22 25.42,10.22 26.18,10.99 27.03,10.99 v27.09,11.04 | X1.2 79.78,44.44 LED1.A
  Top 0.61: IC1.4 55.79,39.49 v56.04,39.74 | IC4.4 56.04,12.82 v56.3,13.07 | IC2.4 55.79,21.71 v56.04,21.96 | IC3.4 v56.04,30.6 | 72.68,44.19 70.05,46.82 C17.+
  Top 1.27: D2.1 D1.1 D4.1 D3.1 D6.1 D5.1 D8.1 D7.1 69,37.07 69,40.51 72.68,44.19 73.7,44.19 | 73.7,44.19 74.33,44.19 | 73.7,44.19 76.36,44.19 X1.2
  Bottom 0.152: v27.09,11.04 29.54,11.04 29.88,10.7 29.88,9.01 29.99,8.9 IC6.IN1+1
  Bottom 0.61: v56.04,21.96 54.52,21.96 | v56.04,30.6 54.52,30.6
  Bottom 0.813: v56.3,13.07 54.52,14.85 54.52,21.96 54.52,26.28 54.52,30.6 54.52,39.74 | 54.52,39.74 54.52,41.52 54.52,43.55 55.15,44.19 | v56.04,39.74 54.52,39.74
  Bottom 1.27: 35.98,24.5 46.63,24.5 48.36,26.23 49.76,26.23 49.81,26.28 | 35.98,24.5 33.95,24.5 | 49.81,26.28 54.52,26.28 54.52,41.52 54.52,43.64 55.52,44.64 76.42,44.64 X1.2 | IC8.IN1+1 49.61,26.28 49.81,26.28 | IC6.IN1+1 31.44,8.9 32.69,10.14 32.69,24.24 32.42,24.5 | 33.95,24.5 35.98,24.5 | IC7.IN1+1 31.8,25.12 32.42,24.5 | 32.42,24.5 33.95,24.5

### Text on the board
tPlace: electronics-shield / ver 7 rev C+ / 2018 Kell ideas Ltd. | VCC | GND | BEFORE SOLDERING / SET TO 6V | IC1 | Default | RPI | BEFORE SOLDERING / SET TO 5V
bPlace: SERVO3 | SERVO2 | SERVO1 | VCC | GND | DATA+ | DATA- | SIG
tNames: VCC | VCC | GND | BEFORE SOLDERING / SET TO 6V | 3V3 | STM32F030C8T6 | 5V
bNames: GND | TIM2 | SCL/TX | +5V | +7V/1 | CLK | MISO | DATA- | GND | GND | MOSI | DATA+ | +5V | GND | TIM3 | TIM1 | SDA/RX | +7V/2 | SWDIO | 3v3 | NC | SWCLK | GND | NRST | Power connector | M12 | M11 | M22 | M21 | M32 | M31 | M42 | M41 | MOTOR / CONNECTOR
_tNames: PiHat / Rev. 7